# EAGLE schematic AMS Segment rev16 (EAGLE 9.6.2)
ENGINEER: Arvind Srinivasan

## Sheet 1 of 2: Schematic
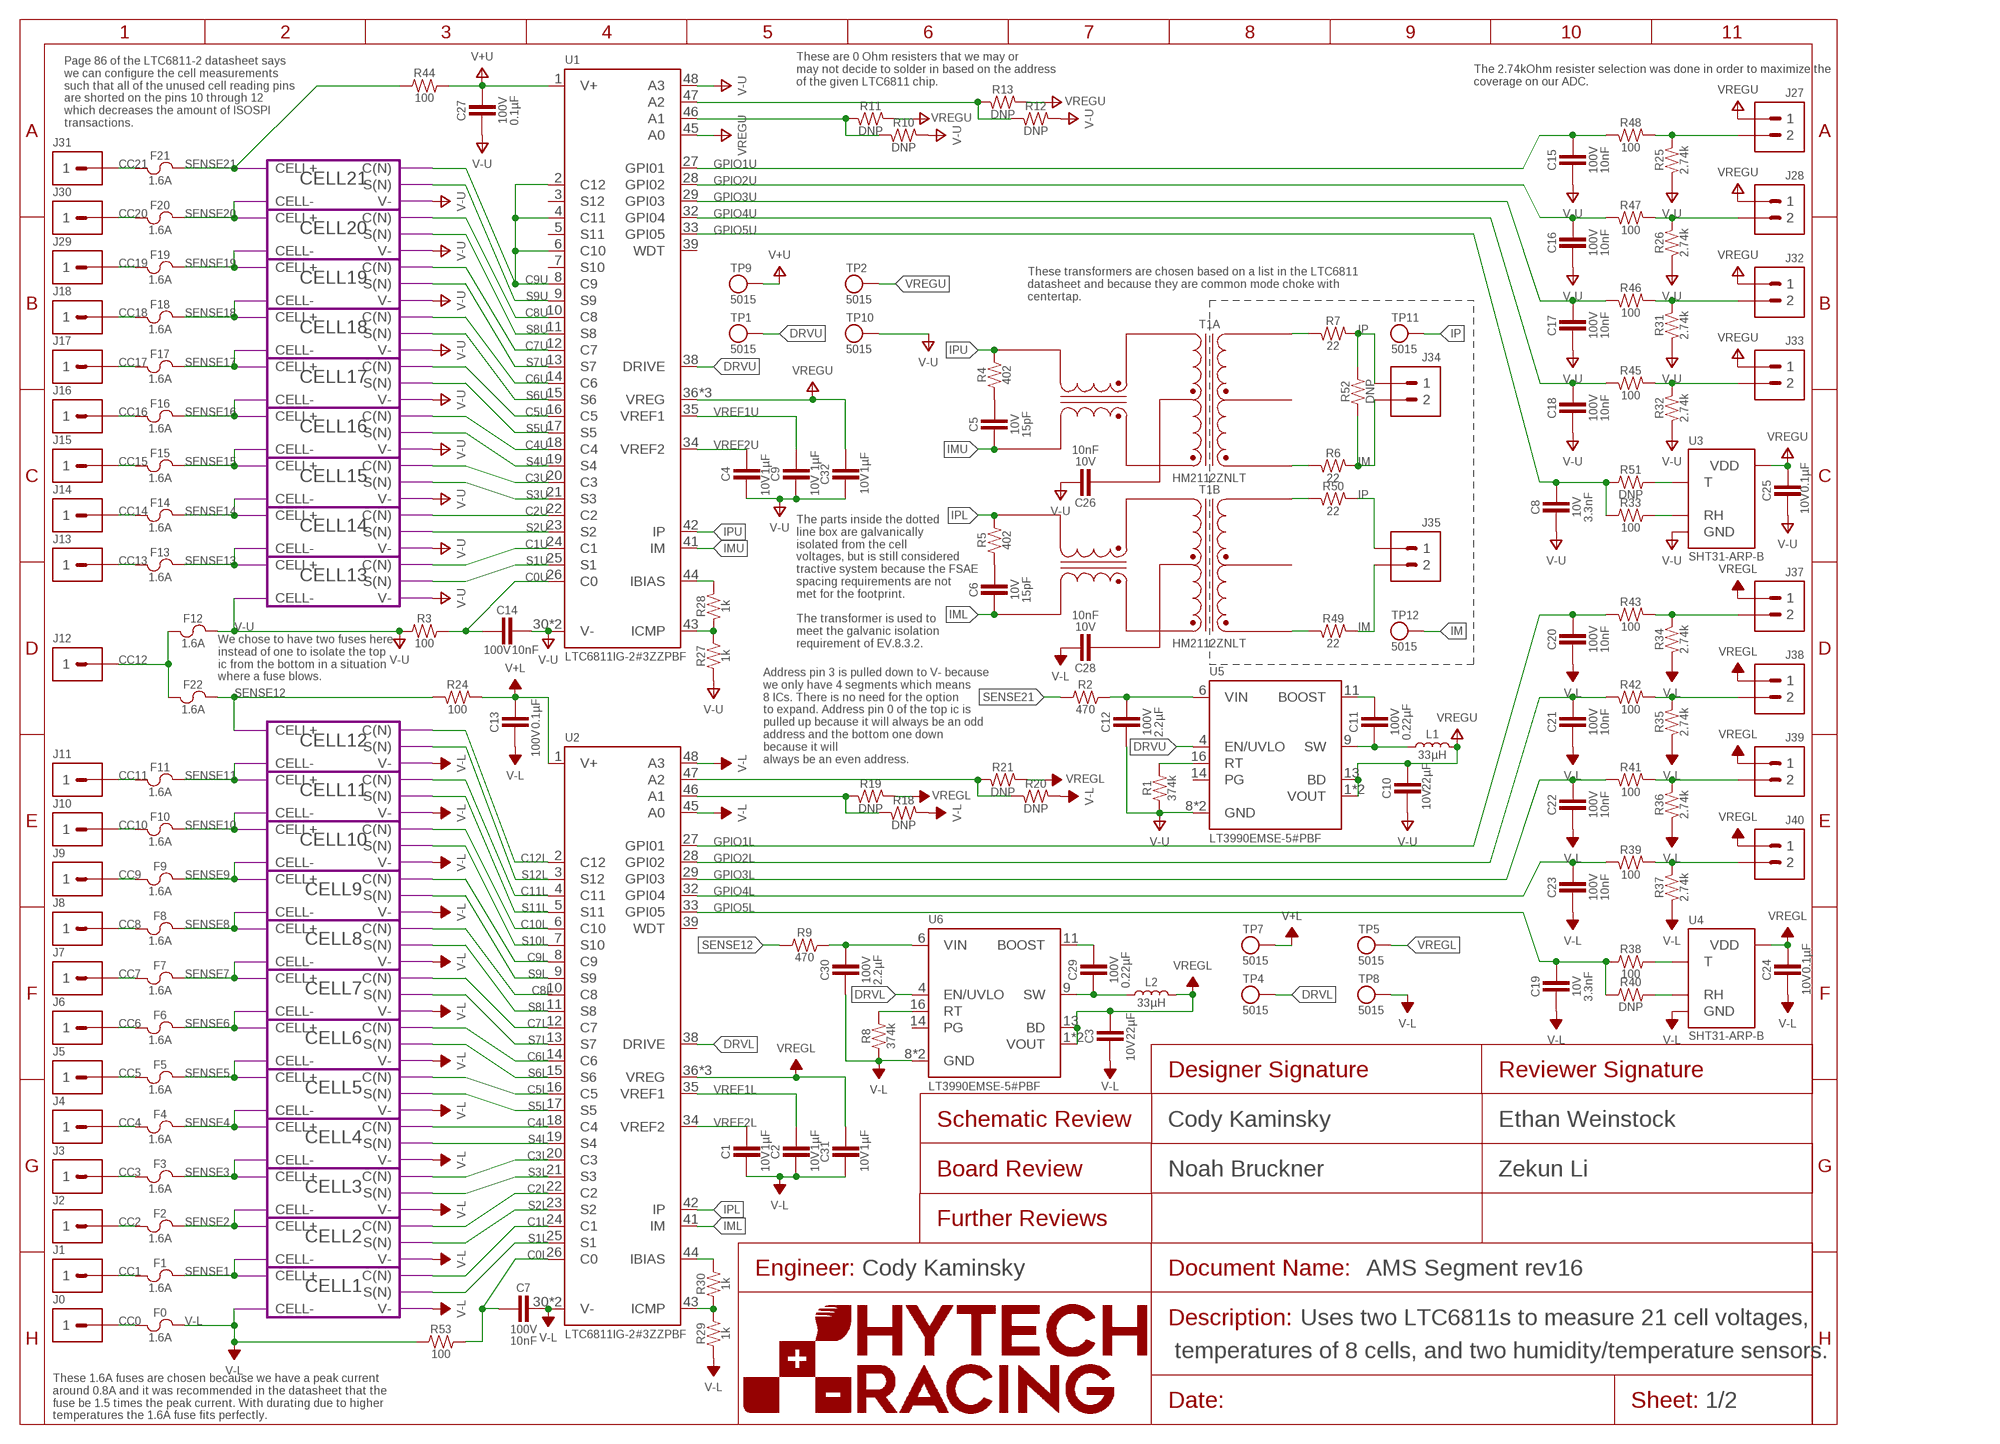
[diagram p0: schematic, sheet 1]
FRAME1 (FRAME): DESCRIPTION_1: Uses two LTC6811s to measure 21 cell voltages,; DESCRIPTION_2: temperatures of 8 cells, and two humidity/temperature sensors.; DESIGNER_BOARD: Noah Bruckner; DESIGNER_SCHEMATIC: Cody Kaminsky; ENGINEER: Cody Kaminsky; REVIEWER_BOARD: Zekun Li; REVIEWER_SCHEMATIC: Ethan Weinstock

### Parts
C1  CAPACITOR_0603_10V_1UF  [0603-CAP]
C2  CAPACITOR_0603_10V_1UF  [0603-CAP]
C3  CAPACITOR_0603_10V_22UF  [0603-CAP]
C4  CAPACITOR_0603_10V_1UF  [0603-CAP]
C5  CAPACITOR_0603_10V_15PF  [0603-CAP]
C6  CAPACITOR_0603_10V_15PF  [0603-CAP]
C7  CAPACITOR_0603_100V_10NF  [0603-CAP]
C8  CAPACITOR_0603_10V_3.3NF  [0603-CAP]
C9  CAPACITOR_0603_10V_1UF  [0603-CAP]
C10  CAPACITOR_0603_10V_22UF  [0603-CAP]
C11  CAPACITOR_0805_100V_0.22UF  [0805-CAP]
C12  CAPACITOR_1206_100V_2.2UF  [1206-CAP]
C13  CAPACITOR_0603_100V_0.1UF  [0603-CAP]
C14  CAPACITOR_0603_100V_10NF  [0603-CAP]
C15  CAPACITOR_0603_100V_10NF  [0603-CAP]
C16  CAPACITOR_0603_100V_10NF  [0603-CAP]
C17  CAPACITOR_0603_100V_10NF  [0603-CAP]
C18  CAPACITOR_0603_100V_10NF  [0603-CAP]
C19  CAPACITOR_0603_10V_3.3NF  [0603-CAP]
C20  CAPACITOR_0603_100V_10NF  [0603-CAP]
C21  CAPACITOR_0603_100V_10NF  [0603-CAP]
C22  CAPACITOR_0603_100V_10NF  [0603-CAP]
C23  CAPACITOR_0603_100V_10NF  [0603-CAP]
C24  CAPACITOR_0603_10V_0.1UF  [0603-CAP]
C25  CAPACITOR_0603_10V_0.1UF  [0603-CAP]
C26  CAPACITOR_0603_10V_10NF  [0603-CAP]
C27  CAPACITOR_0603_100V_0.1UF  [0603-CAP]
C28  CAPACITOR_0603_10V_10NF  [0603-CAP]
C29  CAPACITOR_0805_100V_0.22UF  [0805-CAP]
C30  CAPACITOR_1206_100V_2.2UF  [1206-CAP]
C31  CAPACITOR_0603_10V_1UF  [0603-CAP]
C32  CAPACITOR_0603_10V_1UF  [0603-CAP]
F0  FUSE_0885_1.6  [0885]
F1  FUSE_0885_1.6  [0885]
F2  FUSE_0885_1.6  [0885]
F3  FUSE_0885_1.6  [0885]
F4  FUSE_0885_1.6  [0885]
F5  FUSE_0885_1.6  [0885]
F6  FUSE_0885_1.6  [0885]
F7  FUSE_0885_1.6  [0885]
F8  FUSE_0885_1.6  [0885]
F9  FUSE_0885_1.6  [0885]
F10  FUSE_0885_1.6  [0885]
F11  FUSE_0885_1.6  [0885]
F12  FUSE_0885_1.6  [0885]
F13  FUSE_0885_1.6  [0885]
F14  FUSE_0885_1.6  [0885]
F15  FUSE_0885_1.6  [0885]
F16  FUSE_0885_1.6  [0885]
F17  FUSE_0885_1.6  [0885]
F18  FUSE_0885_1.6  [0885]
F19  FUSE_0885_1.6  [0885]
F20  FUSE_0885_1.6  [0885]
F21  FUSE_0885_1.6  [0885]
F22  FUSE_0885_1.6  [0885]
J0  CONNECTOR-1_5222_  [5222]
J1  CONNECTOR-1_5222_  [5222]
J2  CONNECTOR-1_5222_  [5222]
J3  CONNECTOR-1_5222_  [5222]
J4  CONNECTOR-1_5222_  [5222]
J5  CONNECTOR-1_5222_  [5222]
J6  CONNECTOR-1_5222_  [5222]
J7  CONNECTOR-1_5222_  [5222]
J8  CONNECTOR-1_5222_  [5222]
J9  CONNECTOR-1_5222_  [5222]
J10  CONNECTOR-1_5222_  [5222]
J11  CONNECTOR-1_5222_  [5222]
J12  CONNECTOR-1_5222_  [5222]
J13  CONNECTOR-1_5222_  [5222]
J14  CONNECTOR-1_5222_  [5222]
J15  CONNECTOR-1_5222_  [5222]
J16  CONNECTOR-1_5222_  [5222]
J17  CONNECTOR-1_5222_  [5222]
J18  CONNECTOR-1_5222_  [5222]
J27  CONNECTOR-2_MICROFIT_SMD_RIGHTANGLE_02_SINGLE_BLACK  [MOLEX_MICROFIT_SMD_RIGHTANGLE_02_SINGLE]
J28  CONNECTOR-2_MICROFIT_SMD_RIGHTANGLE_02_SINGLE_BLACK  [MOLEX_MICROFIT_SMD_RIGHTANGLE_02_SINGLE]
J29  CONNECTOR-1_5222_  [5222]
J30  CONNECTOR-1_5222_  [5222]
J31  CONNECTOR-1_5222_  [5222]
J32  CONNECTOR-2_MICROFIT_SMD_RIGHTANGLE_02_SINGLE_BLACK  [MOLEX_MICROFIT_SMD_RIGHTANGLE_02_SINGLE]
J33  CONNECTOR-2_MICROFIT_SMD_RIGHTANGLE_02_SINGLE_BLACK  [MOLEX_MICROFIT_SMD_RIGHTANGLE_02_SINGLE]
J34  CONNECTOR-2_MICROFIT_SMD_RIGHTANGLE_02_SINGLE_BLACK  [MOLEX_MICROFIT_SMD_RIGHTANGLE_02_SINGLE]
J35  CONNECTOR-2_MICROFIT_SMD_RIGHTANGLE_02_SINGLE_BLACK  [MOLEX_MICROFIT_SMD_RIGHTANGLE_02_SINGLE]
J37  CONNECTOR-2_MICROFIT_SMD_RIGHTANGLE_02_SINGLE_BLACK  [MOLEX_MICROFIT_SMD_RIGHTANGLE_02_SINGLE]
J38  CONNECTOR-2_MICROFIT_SMD_RIGHTANGLE_02_SINGLE_BLACK  [MOLEX_MICROFIT_SMD_RIGHTANGLE_02_SINGLE]
J39  CONNECTOR-2_MICROFIT_SMD_RIGHTANGLE_02_SINGLE_BLACK  [MOLEX_MICROFIT_SMD_RIGHTANGLE_02_SINGLE]
J40  CONNECTOR-2_MICROFIT_SMD_RIGHTANGLE_02_SINGLE_BLACK  [MOLEX_MICROFIT_SMD_RIGHTANGLE_02_SINGLE]
L1  INDUCTOR_74451133_33UH  [74451133]
L2  INDUCTOR_74451133_33UH  [74451133]
R1  RESISTOR_0603_374K  [0603-RES]
R2  RESISTOR_0603_470  [0603-RES]
R3  RESISTOR_0603_100  [0603-RES]
R4  RESISTOR_0603_402  [0603-RES]
R5  RESISTOR_0603_402  [0603-RES]
R6  RESISTOR_0603_22  [0603-RES]
R7  RESISTOR_0603_22  [0603-RES]
R8  RESISTOR_0603_374K  [0603-RES]
R9  RESISTOR_0603_470  [0603-RES]
R10  RESISTOR_0603_DNP  [0603-RES]
R11  RESISTOR_0603_DNP  [0603-RES]
R12  RESISTOR_0603_DNP  [0603-RES]
R13  RESISTOR_0603_DNP  [0603-RES]
R18  RESISTOR_0603_DNP  [0603-RES]
R19  RESISTOR_0603_DNP  [0603-RES]
R20  RESISTOR_0603_DNP  [0603-RES]
R21  RESISTOR_0603_DNP  [0603-RES]
R24  RESISTOR_0603_100  [0603-RES]
R25  RESISTOR_0603_2.74K  [0603-RES]
R26  RESISTOR_0603_2.74K  [0603-RES]
R27  RESISTOR_0603_1K  [0603-RES]
R28  RESISTOR_0603_1K  [0603-RES]
R29  RESISTOR_0603_1K  [0603-RES]
R30  RESISTOR_0603_1K  [0603-RES]
R31  RESISTOR_0603_2.74K  [0603-RES]
R32  RESISTOR_0603_2.74K  [0603-RES]
R33  RESISTOR_0603_100  [0603-RES]
R34  RESISTOR_0603_2.74K  [0603-RES]
R35  RESISTOR_0603_2.74K  [0603-RES]
R36  RESISTOR_0603_2.74K  [0603-RES]
R37  RESISTOR_0603_2.74K  [0603-RES]
R38  RESISTOR_0603_100  [0603-RES]
R39  RESISTOR_0603_100  [0603-RES]
R40  RESISTOR_0603_DNP  [0603-RES]
R41  RESISTOR_0603_100  [0603-RES]
R42  RESISTOR_0603_100  [0603-RES]
R43  RESISTOR_0603_100  [0603-RES]
R44  RESISTOR_0603_100  [0603-RES]
R45  RESISTOR_0603_100  [0603-RES]
R46  RESISTOR_0603_100  [0603-RES]
R47  RESISTOR_0603_100  [0603-RES]
R48  RESISTOR_0603_100  [0603-RES]
R49  RESISTOR_0603_22  [0603-RES]
R50  RESISTOR_0603_22  [0603-RES]
R51  RESISTOR_0603_DNP  [0603-RES]
R52  RESISTOR_0603_DNP  [0603-RES]
R53  RESISTOR_0603_100  [0603-RES]
T1  TRANSFORMER_HM2112ZNLT  [HM2112ZNLT]
TP1  TEST_POINT  [MICRO_MINIATURE]
TP2  TEST_POINT  [MICRO_MINIATURE]
TP4  TEST_POINT  [MICRO_MINIATURE]
TP5  TEST_POINT  [MICRO_MINIATURE]
TP7  TEST_POINT  [MICRO_MINIATURE]
TP8  TEST_POINT  [MICRO_MINIATURE]
TP9  TEST_POINT  [MICRO_MINIATURE]
TP10  TEST_POINT  [MICRO_MINIATURE]
TP11  TEST_POINT  [MICRO_MINIATURE]
TP12  TEST_POINT  [MICRO_MINIATURE]
U1  LTC6811-2  [SSOP-48]
U2  LTC6811-2  [SSOP-48]
U3  SHT31-ARP-B  [DFN-8]
U4  SHT31-ARP-B  [DFN-8]
U5  LT3990-5  [MSOP-16(MSE)]
U6  LT3990-5  [MSOP-16(MSE)]

### Module instances
CELL1 = CELL
CELL2 = CELL
CELL3 = CELL
CELL4 = CELL
CELL5 = CELL
CELL6 = CELL
CELL7 = CELL
CELL8 = CELL
CELL9 = CELL
CELL10 = CELL
CELL11 = CELL
CELL12 = CELL
CELL13 = CELL
CELL14 = CELL
CELL15 = CELL
CELL16 = CELL
CELL17 = CELL
CELL18 = CELL
CELL19 = CELL
CELL20 = CELL
CELL21 = CELL

### Nets
C0L [Lower Power]: C7.1 R53.2 U2.26(C0)
C0U [Upper Power]: C14.1 R3.2 U1.26(C0)
C1L [Lower Power]: U2.24(C1) ; port CELL1.C(N)
C1U [Upper Power]: U1.24(C1) ; port CELL13.C(N)
C2L [Lower Power]: U2.22(C2) ; port CELL2.C(N)
C2U [Upper Power]: U1.22(C2) ; port CELL14.C(N)
C3L [Lower Power]: U2.20(C3) ; port CELL3.C(N)
C3U [Upper Power]: U1.20(C3) ; port CELL15.C(N)
C4L [Lower Power]: U2.18(C4) ; port CELL4.C(N)
C4U [Upper Power]: U1.18(C4) ; port CELL16.C(N)
C5L [Lower Power]: U2.16(C5) ; port CELL5.C(N)
C5U [Upper Power]: U1.16(C5) ; port CELL17.C(N)
C6L [Lower Power]: U2.14(C6) ; port CELL6.C(N)
C6U [Upper Power]: U1.14(C6) ; port CELL18.C(N)
C7L [Lower Power]: U2.12(C7) ; port CELL7.C(N)
C7U [Upper Power]: U1.12(C7) ; port CELL19.C(N)
C8L [Lower Power]: U2.10(C8) ; port CELL8.C(N)
C8U [Upper Power]: U1.10(C8) ; port CELL20.C(N)
C9L [Lower Power]: U2.8(C9) ; port CELL9.C(N)
C9U [Upper Power]: U1.2(C12) U1.4(C11) U1.6(C10) U1.8(C9) ; port CELL21.C(N)
C10L [Lower Power]: U2.6(C10) ; port CELL10.C(N)
C11L [Lower Power]: U2.4(C11) ; port CELL11.C(N)
C12L [Lower Power]: U2.2(C12) ; port CELL12.C(N)
CC0 [Lower_Unfused]: F0.1 J0.1
CC1 [Lower_Unfused]: F1.1 J1.1
CC2 [Lower_Unfused]: F2.1 J2.1
CC3 [Lower_Unfused]: F3.1 J3.1
CC4 [Lower_Unfused]: F4.1 J4.1
CC5 [Lower_Unfused]: F5.1 J5.1
CC6 [Lower_Unfused]: F6.1 J6.1
CC7 [Lower_Unfused]: F7.1 J7.1
CC8 [Lower_Unfused]: F8.1 J8.1
CC9 [Lower_Unfused]: F9.1 J9.1
CC10 [Lower_Unfused]: F10.1 J10.1
CC11 [Lower_Unfused]: F11.1 J11.1
CC12 [Upper_Unfused]: F12.1 F22.1 J12.1
CC13 [Upper_Unfused]: F13.1 J13.1
CC14 [Upper_Unfused]: F14.1 J14.1
CC15 [Upper_Unfused]: F15.1 J15.1
CC16 [Upper_Unfused]: F16.1 J16.1
CC17 [Upper_Unfused]: F17.1 J17.1
CC18 [Upper_Unfused]: F18.1 J18.1
CC19 [Upper_Unfused]: F19.1 J29.1
CC20 [Upper_Unfused]: F20.1 J30.1
CC21 [Upper_Unfused]: F21.1 J31.1
DRVL [Lower Power]: TP4.1 U2.38(DRIVE) U6.4(EN/UVLO)
DRVU [Upper Power]: TP1.1 U1.38(DRIVE) U5.4(EN/UVLO)
GPIO1L: C20.1 R43.2 U2.27(GPI01)
GPIO1U: C15.1 R48.2 U1.27(GPI01)
GPIO2L: C21.1 R42.2 U2.28(GPI02)
GPIO2U: C16.1 R47.2 U1.28(GPI02)
GPIO3L: C22.1 R41.2 U2.29(GPI03)
GPIO3U: C17.1 R46.2 U1.29(GPI03)
GPIO4L: C23.1 R39.2 U2.32(GPI04)
GPIO4U: C18.1 R45.2 U1.32(GPI04)
GPIO5L: C19.1 R38.1 R40.1 U2.33(GPI05)
GPIO5U: C8.1 R33.1 R51.1 U1.33(GPI05)
IM [IsoSPI]: J34.2 J35.2 R6.1 R49.1 R52.1 TP12.1
IML: C6.2 T1.9(B:TD+) U2.41(IM)
IMU: C5.2 T1.12(A:TD+) U1.41(IM)
IP [IsoSPI]: J34.1 J35.1 R7.1 R50.1 R52.2 TP11.1
IPL: R5.2 T1.7(B:TD-) U2.42(IP)
IPU: R4.2 T1.10(A:TD-) U1.42(IP)
N$1: R1.2 U5.16(RT)
N$3: C11.2 L1.1 U5.9(SW)
N$4: C11.1 U5.11(BOOST)
N$7: R8.2 U6.16(RT)
N$10: C29.2 L2.1 U6.9(SW)
N$11: C29.1 U6.11(BOOST)
N$12: R33.2 U3.1(RH)
N$18: C26.2 T1.11(A:TCT)
N$22 [IsoSPI]: R6.2 T1.1(A:MX+)
N$25: R10.2 R11.2 U1.46(A1)
N$27 [IsoSPI]: R7.2 T1.3(A:MX-)
N$29: C28.2 T1.8(B:TCT)
N$30: R51.2 U3.4(T)
N$32 [IsoSPI]: R49.2 T1.4(B:MX+)
N$33 [IsoSPI]: R50.2 T1.6(B:MX-)
N$54: R12.2 R13.2 U1.47(A2)
N$61: R27.2 R28.2 U1.43(ICMP)
N$67: R18.2 R19.2 U2.46(A1)
N$68: R20.2 R21.2 U2.47(A2)
N$70: R28.1 U1.44(IBIAS)
N$71: J27.2 R25.1 R48.1
N$72: R29.2 R30.1 U2.43(ICMP)
N$73: R30.2 U2.44(IBIAS)
N$76: J28.2 R26.1 R47.1
N$78: J32.2 R31.1 R46.1
N$80: J33.2 R32.1 R45.1
N$81: R40.2 U4.1(RH)
N$83: R38.2 U4.4(T)
N$84: J37.2 R34.1 R43.1
N$86: J38.2 R35.1 R42.1
N$88: J39.2 R36.1 R41.1
N$90: J40.2 R37.1 R39.1
N$97: C5.1 R4.1
N$99: C6.1 R5.1
S1L [Lower Power]: U2.25(S1) ; port CELL1.S(N)
S1U [Upper Power]: U1.25(S1) ; port CELL13.S(N)
S2L [Lower Power]: U2.23(S2) ; port CELL2.S(N)
S2U [Upper Power]: U1.23(S2) ; port CELL14.S(N)
S3L [Lower Power]: U2.21(S3) ; port CELL3.S(N)
S3U [Upper Power]: U1.21(S3) ; port CELL15.S(N)
S4L [Lower Power]: U2.19(S4) ; port CELL4.S(N)
S4U [Upper Power]: U1.19(S4) ; port CELL16.S(N)
S5L [Lower Power]: U2.17(S5) ; port CELL5.S(N)
S5U [Upper Power]: U1.17(S5) ; port CELL17.S(N)
S6L [Lower Power]: U2.15(S6) ; port CELL6.S(N)
S6U [Upper Power]: U1.15(S6) ; port CELL18.S(N)
S7L [Lower Power]: U2.13(S7) ; port CELL7.S(N)
S7U [Upper Power]: U1.13(S7) ; port CELL19.S(N)
S8L [Lower Power]: U2.11(S8) ; port CELL8.S(N)
S8U [Upper Power]: U1.11(S8) ; port CELL20.S(N)
S9L [Lower Power]: U2.9(S9) ; port CELL9.S(N)
S9U [Upper Power]: U1.9(S9) ; port CELL21.S(N)
S10L [Lower Power]: U2.7(S10) ; port CELL10.S(N)
S11L [Lower Power]: U2.5(S11) ; port CELL11.S(N)
S12L [Lower Power]: U2.3(S12) ; port CELL12.S(N)
SENSE1 [Lower Power]: F1.2 ; port CELL1.CELL+ CELL2.CELL-
SENSE2 [Lower Power]: F2.2 ; port CELL2.CELL+ CELL3.CELL-
SENSE3 [Lower Power]: F3.2 ; port CELL3.CELL+ CELL4.CELL-
SENSE4 [Lower Power]: F4.2 ; port CELL4.CELL+ CELL5.CELL-
SENSE5 [Lower Power]: F5.2 ; port CELL5.CELL+ CELL6.CELL-
SENSE6 [Lower Power]: F6.2 ; port CELL6.CELL+ CELL7.CELL-
SENSE7 [Lower Power]: F7.2 ; port CELL7.CELL+ CELL8.CELL-
SENSE8 [Lower Power]: F8.2 ; port CELL8.CELL+ CELL9.CELL-
SENSE9 [Lower Power]: F9.2 ; port CELL9.CELL+ CELL10.CELL-
SENSE10 [Lower Power]: F10.2 ; port CELL10.CELL+ CELL11.CELL-
SENSE11 [Lower Power]: F11.2 ; port CELL11.CELL+ CELL12.CELL-
SENSE12 [Lower Power]: F22.2 R9.1 R24.2 ; port CELL12.CELL+
SENSE13 [Upper Power]: F13.2 ; port CELL13.CELL+ CELL14.CELL-
SENSE14 [Upper Power]: F14.2 ; port CELL14.CELL+ CELL15.CELL-
SENSE15 [Upper Power]: F15.2 ; port CELL15.CELL+ CELL16.CELL-
SENSE16 [Upper Power]: F16.2 ; port CELL16.CELL+ CELL17.CELL-
SENSE17 [Upper Power]: F17.2 ; port CELL17.CELL+ CELL18.CELL-
SENSE18 [Upper Power]: F18.2 ; port CELL18.CELL+ CELL19.CELL-
SENSE19 [Upper Power]: F19.2 ; port CELL19.CELL+ CELL20.CELL-
SENSE20 [Upper Power]: F20.2 ; port CELL20.CELL+ CELL21.CELL-
SENSE21 [Upper Power]: F21.2 R2.1 R44.1 ; port CELL21.CELL+
V+L [Lower Power]: C13.1 R24.1 TP7.1 U2.1(V+)
V+U [Upper Power]: C27.1 R44.2 TP9.1 U1.1(V+)
V-L [Lower Power]: C1.2 C2.2 C3.2 C7.2 C13.2 C19.2 C20.2 C21.2 C22.2 C23.2 C24.2 C28.1 C30.2 C31.2 F0.2 R8.1 R18.1 R20.1 R29.1 R34.2 R35.2 R36.2 R37.2 R53.1 TP8.1 U2.30(V-) U2.31(V-) U2.45(A0) U2.48(A3) U4.2(GND) U4.3(GND) U4.7(GND) U4.8(GND) U4.PAD(GND) U6.8(GND) U6.17(GND) ; port CELL12.V- CELL11.V- CELL10.V- CELL9.V- CELL8.V- CELL7.V- CELL6.V- CELL5.V- CELL4.V- CELL3.V- CELL2.V- CELL1.V- CELL1.CELL-
V-U [Upper Power]: C4.2 C8.2 C9.2 C10.2 C12.2 C14.2 C15.2 C16.2 C17.2 C18.2 C25.2 C26.1 C27.2 C32.2 F12.2 R1.1 R3.1 R10.1 R12.1 R25.2 R26.2 R27.1 R31.2 R32.2 TP10.1 U1.30(V-) U1.31(V-) U1.48(A3) U3.2(GND) U3.3(GND) U3.7(GND) U3.8(GND) U3.PAD(GND) U5.8(GND) U5.17(GND) ; port CELL21.V- CELL20.V- CELL19.V- CELL18.V- CELL17.V- CELL16.V- CELL15.V- CELL14.V- CELL13.V- CELL13.CELL-
VINL: C30.1 R9.2 U6.6(VIN)
VINU: C12.1 R2.2 U5.6(VIN)
VREF1L [Lower Power]: C2.1 U2.35(VREF1)
VREF1U [Upper Power]: C9.1 U1.35(VREF1)
VREF2L [Lower Power]: C1.1 U2.34(VREF2)
VREF2U [Upper Power]: C4.1 U1.34(VREF2)
VREGL [Lower Power]: C3.1 C24.1 C31.1 J37.1 J38.1 J39.1 J40.1 L2.2 R19.1 R21.1 TP5.1 U2.36(VREG) U2.37(VREG) U2.40(VREG) U4.5(VDD) U6.1(VOUT) U6.2(VOUT) U6.13(BD)
VREGU [Upper Power]: C10.1 C25.1 C32.1 J27.1 J28.1 J32.1 J33.1 L1.2 R11.1 R13.1 TP2.1 U1.36(VREG) U1.37(VREG) U1.40(VREG) U1.45(A0) U3.5(VDD) U5.1(VOUT) U5.2(VOUT) U5.13(BD)
Unconnected: T1.2(A:MCT) T1.5(B:MCT) U1.3(S12) U1.5(S11) U1.7(S10) U1.39(WDT) U2.39(WDT) U5.14(PG) U6.14(PG)

### Notes on the sheet
- These are 0 Ohm resisters that we may or 
  may not decide to solder in based on the address
  of the given LTC6811 chip.
- The 2.74kOhm resister selection was done in order to maximize the
  coverage on our ADC.
- Page 86 of the LTC6811-2 datasheet says
  we can configure the cell measurements
  such that all of the unused cell reading pins
  are shorted on the pins 10 through 12
  which decreases the amount of ISOSPI
  transactions.
- These transformers are chosen based on a list in the LTC6811
  datasheet and because they are common mode choke with
  centertap.
- The parts inside the dotted
  line box are galvanically
  isolated from the cell
  voltages, but is still considered
  tractive system because the FSAE
  spacing requirements are not
  met for the footprint.
  
  The transformer is used to
  meet the galvanic isolation
  requirement of EV.8.3.2.
- We chose to have two fuses here 
  instead of one to isolate the top 
  ic from the bottom in a situation 
  where a fuse blows.
- Address pin 3 is pulled down to V- because 
  we only have 4 segments which means
  8 ICs. There is no need for the option
  to expand. Address pin 0 of the top ic is
  pulled up because it will always be an odd
  address and the bottom one down
  because it will 
  always be an even address.
- These 1.6A fuses are chosen because we have a peak current
  around 0.8A and it was recommended in the datasheet that the
  fuse be 1.5 times the peak current. With durating due to higher
  temperatures the 1.6A fuse fits perfectly.

## Sheet 2 of 2
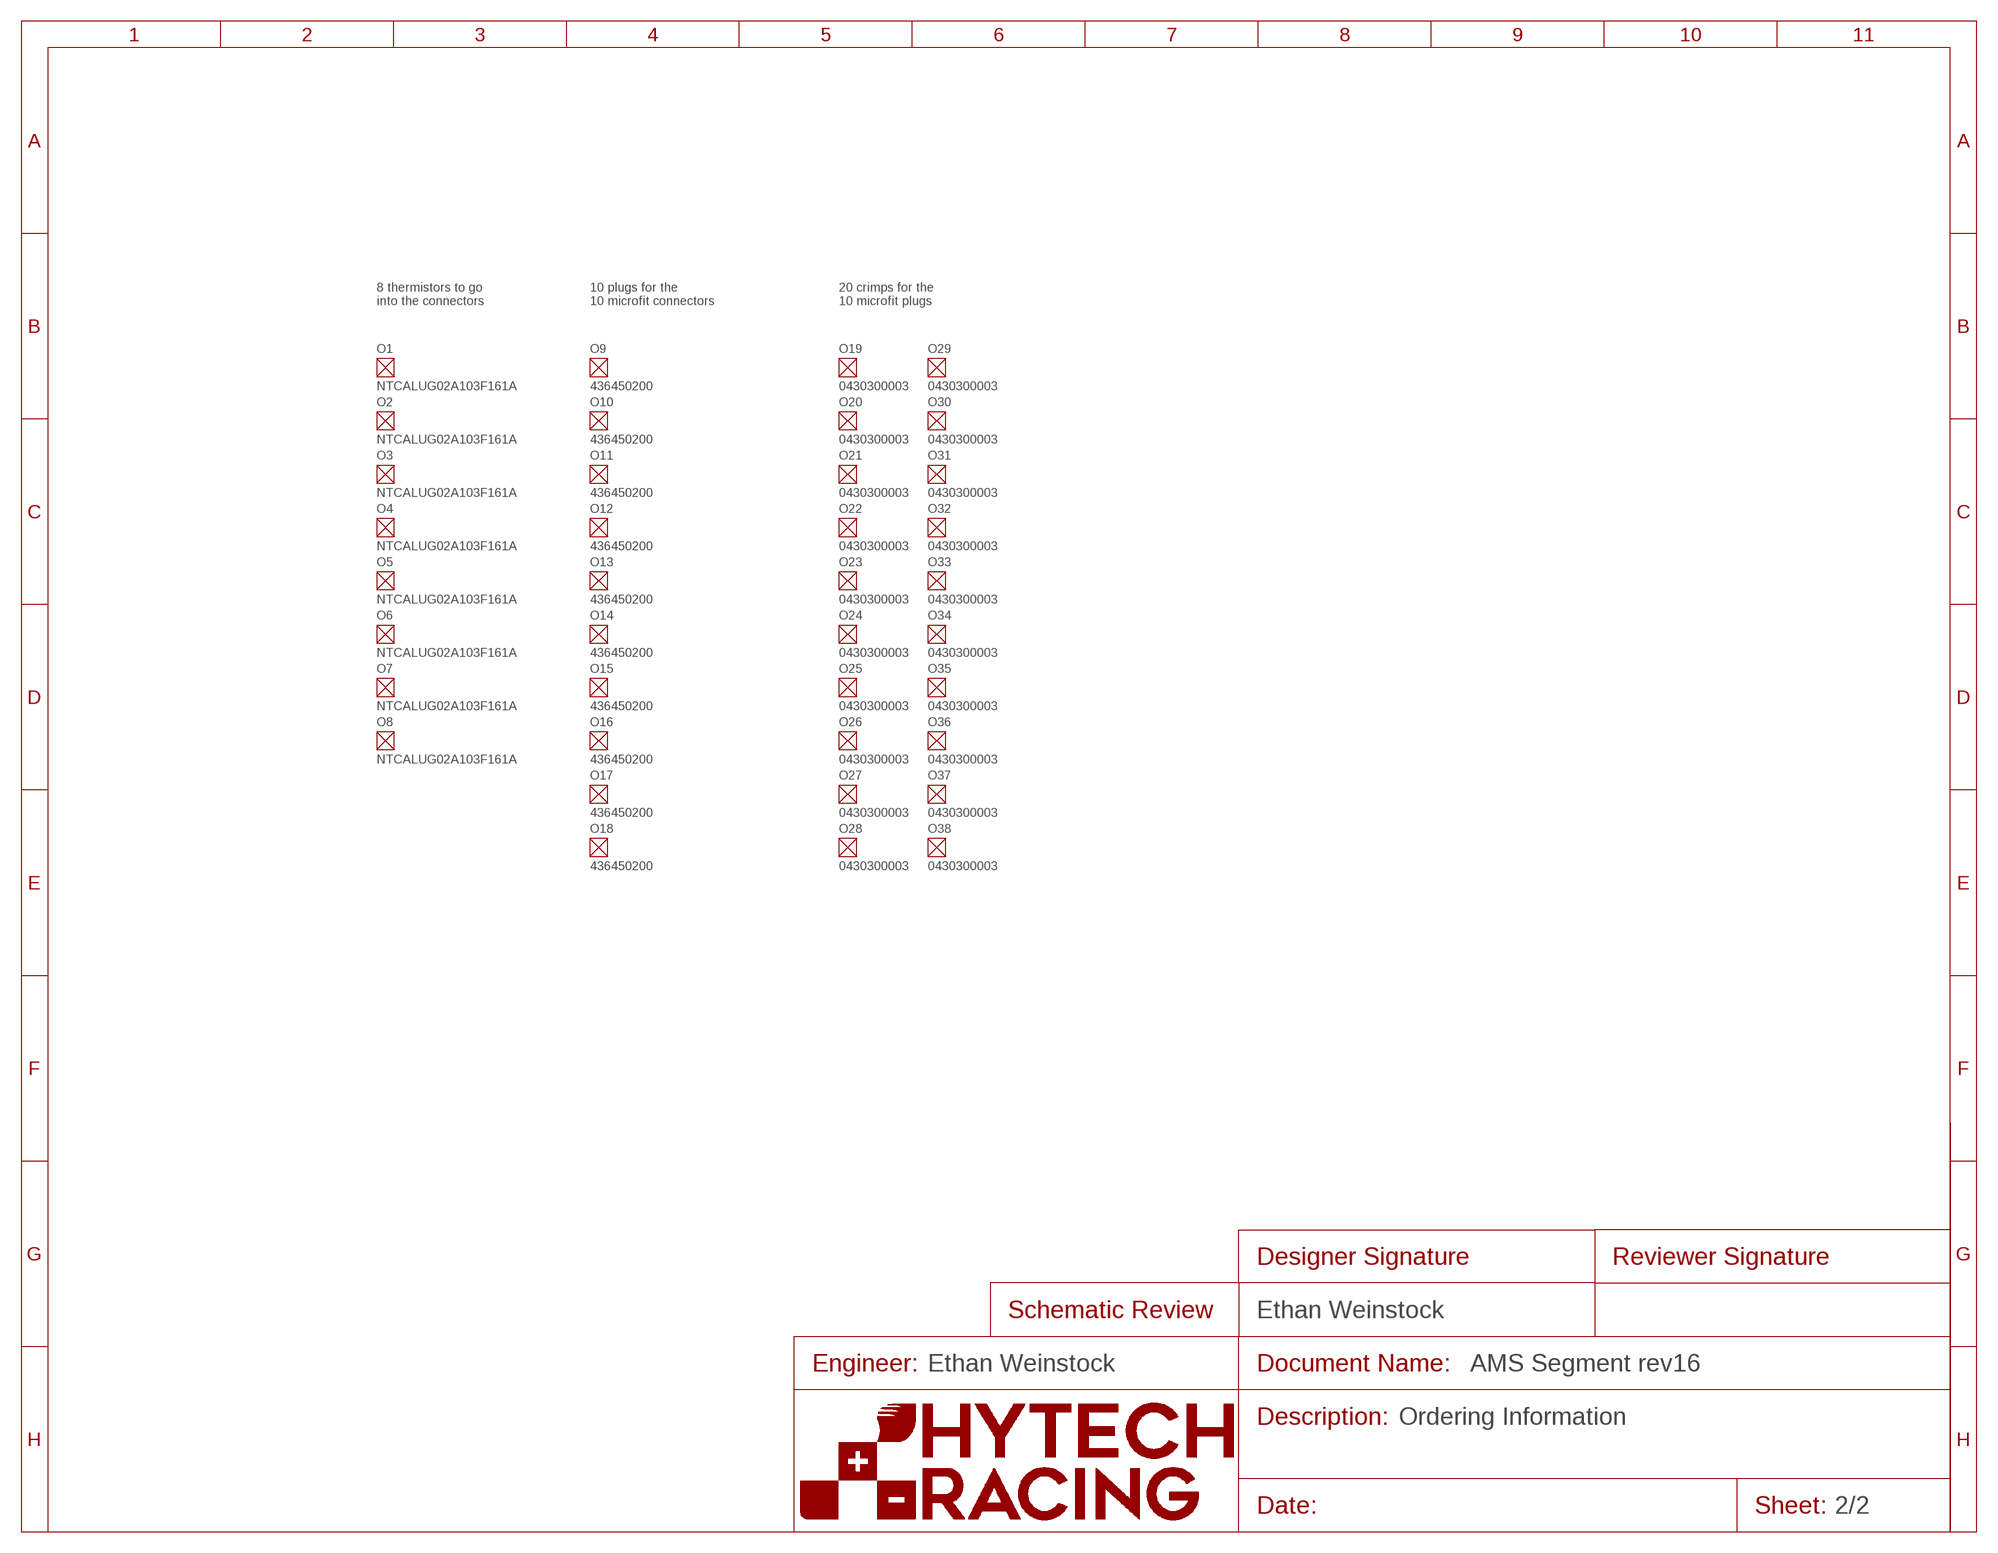
[diagram p1: schematic, sheet 2]
O1 (THERMISTOR): B: 3984K; B_RANGE: 25/85; DKPN: 56-NTCALUG02A103F161A-ND; MANUFACTURER: Vishay Beyschlag/Draloric/BC Components; MOPN: 594-NTLUG02A103F161A; MPN: NTCALUG02A103F161A; TOLERANCE_B: 0.5%; TOLERANCE_RESISTANCE: 1%
O2 (THERMISTOR): B: 3984K; B_RANGE: 25/85; DKPN: 56-NTCALUG02A103F161A-ND; MANUFACTURER: Vishay Beyschlag/Draloric/BC Components; MOPN: 594-NTLUG02A103F161A; MPN: NTCALUG02A103F161A; TOLERANCE_B: 0.5%; TOLERANCE_RESISTANCE: 1%
O3 (THERMISTOR): B: 3984K; B_RANGE: 25/85; DKPN: 56-NTCALUG02A103F161A-ND; MANUFACTURER: Vishay Beyschlag/Draloric/BC Components; MOPN: 594-NTLUG02A103F161A; MPN: NTCALUG02A103F161A; TOLERANCE_B: 0.5%; TOLERANCE_RESISTANCE: 1%
O4 (THERMISTOR): B: 3984K; B_RANGE: 25/85; DKPN: 56-NTCALUG02A103F161A-ND; MANUFACTURER: Vishay Beyschlag/Draloric/BC Components; MOPN: 594-NTLUG02A103F161A; MPN: NTCALUG02A103F161A; TOLERANCE_B: 0.5%; TOLERANCE_RESISTANCE: 1%
O5 (THERMISTOR): B: 3984K; B_RANGE: 25/85; DKPN: 56-NTCALUG02A103F161A-ND; MANUFACTURER: Vishay Beyschlag/Draloric/BC Components; MOPN: 594-NTLUG02A103F161A; MPN: NTCALUG02A103F161A; TOLERANCE_B: 0.5%; TOLERANCE_RESISTANCE: 1%
O6 (THERMISTOR): B: 3984K; B_RANGE: 25/85; DKPN: 56-NTCALUG02A103F161A-ND; MANUFACTURER: Vishay Beyschlag/Draloric/BC Components; MOPN: 594-NTLUG02A103F161A; MPN: NTCALUG02A103F161A; TOLERANCE_B: 0.5%; TOLERANCE_RESISTANCE: 1%
O7 (THERMISTOR): B: 3984K; B_RANGE: 25/85; DKPN: 56-NTCALUG02A103F161A-ND; MANUFACTURER: Vishay Beyschlag/Draloric/BC Components; MOPN: 594-NTLUG02A103F161A; MPN: NTCALUG02A103F161A; TOLERANCE_B: 0.5%; TOLERANCE_RESISTANCE: 1%
O8 (THERMISTOR): B: 3984K; B_RANGE: 25/85; DKPN: 56-NTCALUG02A103F161A-ND; MANUFACTURER: Vishay Beyschlag/Draloric/BC Components; MOPN: 594-NTLUG02A103F161A; MPN: NTCALUG02A103F161A; TOLERANCE_B: 0.5%; TOLERANCE_RESISTANCE: 1%
O9 (PLUG-2_MICROFIT_HORIZONTAL): DKPN: WM1845-ND; MANUFACTURER: Molex; MOPN: Molex; MPN: 436450200
O10 (PLUG-2_MICROFIT_HORIZONTAL): DKPN: WM1845-ND; MANUFACTURER: Molex; MOPN: Molex; MPN: 436450200
O11 (PLUG-2_MICROFIT_HORIZONTAL): DKPN: WM1845-ND; MANUFACTURER: Molex; MOPN: Molex; MPN: 436450200
O12 (PLUG-2_MICROFIT_HORIZONTAL): DKPN: WM1845-ND; MANUFACTURER: Molex; MOPN: Molex; MPN: 436450200
O13 (PLUG-2_MICROFIT_HORIZONTAL): DKPN: WM1845-ND; MANUFACTURER: Molex; MOPN: Molex; MPN: 436450200
O14 (PLUG-2_MICROFIT_HORIZONTAL): DKPN: WM1845-ND; MANUFACTURER: Molex; MOPN: Molex; MPN: 436450200
O15 (PLUG-2_MICROFIT_HORIZONTAL): DKPN: WM1845-ND; MANUFACTURER: Molex; MOPN: Molex; MPN: 436450200
O16 (PLUG-2_MICROFIT_HORIZONTAL): DKPN: WM1845-ND; MANUFACTURER: Molex; MOPN: Molex; MPN: 436450200
O17 (PLUG-2_MICROFIT_HORIZONTAL): DKPN: WM1845-ND; MANUFACTURER: Molex; MOPN: Molex; MPN: 436450200
O18 (PLUG-2_MICROFIT_HORIZONTAL): DKPN: WM1845-ND; MANUFACTURER: Molex; MOPN: Molex; MPN: 436450200
O19 (CRIMP_MICROFIT_20-24): DKPN: WM2776CT-ND; GAUGE: 20-24; MANUFACTURER: Molex; MOPN: 538-43030-0003; MPN: 0430300003
O20 (CRIMP_MICROFIT_20-24): DKPN: WM2776CT-ND; GAUGE: 20-24; MANUFACTURER: Molex; MOPN: 538-43030-0003; MPN: 0430300003
O21 (CRIMP_MICROFIT_20-24): DKPN: WM2776CT-ND; GAUGE: 20-24; MANUFACTURER: Molex; MOPN: 538-43030-0003; MPN: 0430300003
O22 (CRIMP_MICROFIT_20-24): DKPN: WM2776CT-ND; GAUGE: 20-24; MANUFACTURER: Molex; MOPN: 538-43030-0003; MPN: 0430300003
O23 (CRIMP_MICROFIT_20-24): DKPN: WM2776CT-ND; GAUGE: 20-24; MANUFACTURER: Molex; MOPN: 538-43030-0003; MPN: 0430300003
O24 (CRIMP_MICROFIT_20-24): DKPN: WM2776CT-ND; GAUGE: 20-24; MANUFACTURER: Molex; MOPN: 538-43030-0003; MPN: 0430300003
O25 (CRIMP_MICROFIT_20-24): DKPN: WM2776CT-ND; GAUGE: 20-24; MANUFACTURER: Molex; MOPN: 538-43030-0003; MPN: 0430300003
O26 (CRIMP_MICROFIT_20-24): DKPN: WM2776CT-ND; GAUGE: 20-24; MANUFACTURER: Molex; MOPN: 538-43030-0003; MPN: 0430300003
O27 (CRIMP_MICROFIT_20-24): DKPN: WM2776CT-ND; GAUGE: 20-24; MANUFACTURER: Molex; MOPN: 538-43030-0003; MPN: 0430300003
O28 (CRIMP_MICROFIT_20-24): DKPN: WM2776CT-ND; GAUGE: 20-24; MANUFACTURER: Molex; MOPN: 538-43030-0003; MPN: 0430300003
O29 (CRIMP_MICROFIT_20-24): DKPN: WM2776CT-ND; GAUGE: 20-24; MANUFACTURER: Molex; MOPN: 538-43030-0003; MPN: 0430300003
O30 (CRIMP_MICROFIT_20-24): DKPN: WM2776CT-ND; GAUGE: 20-24; MANUFACTURER: Molex; MOPN: 538-43030-0003; MPN: 0430300003
O31 (CRIMP_MICROFIT_20-24): DKPN: WM2776CT-ND; GAUGE: 20-24; MANUFACTURER: Molex; MOPN: 538-43030-0003; MPN: 0430300003
O32 (CRIMP_MICROFIT_20-24): DKPN: WM2776CT-ND; GAUGE: 20-24; MANUFACTURER: Molex; MOPN: 538-43030-0003; MPN: 0430300003
O33 (CRIMP_MICROFIT_20-24): DKPN: WM2776CT-ND; GAUGE: 20-24; MANUFACTURER: Molex; MOPN: 538-43030-0003; MPN: 0430300003
O34 (CRIMP_MICROFIT_20-24): DKPN: WM2776CT-ND; GAUGE: 20-24; MANUFACTURER: Molex; MOPN: 538-43030-0003; MPN: 0430300003
O35 (CRIMP_MICROFIT_20-24): DKPN: WM2776CT-ND; GAUGE: 20-24; MANUFACTURER: Molex; MOPN: 538-43030-0003; MPN: 0430300003
O36 (CRIMP_MICROFIT_20-24): DKPN: WM2776CT-ND; GAUGE: 20-24; MANUFACTURER: Molex; MOPN: 538-43030-0003; MPN: 0430300003
O37 (CRIMP_MICROFIT_20-24): DKPN: WM2776CT-ND; GAUGE: 20-24; MANUFACTURER: Molex; MOPN: 538-43030-0003; MPN: 0430300003
O38 (CRIMP_MICROFIT_20-24): DKPN: WM2776CT-ND; GAUGE: 20-24; MANUFACTURER: Molex; MOPN: 538-43030-0003; MPN: 0430300003
U$30 (FRAME_SCHEMATIC_ONLY): DESCRIPTION_1: Ordering Information; DESIGNER_SCHEMATIC: Ethan Weinstock; ENGINEER: Ethan Weinstock

### Notes on the sheet
- 8 thermistors to go
  into the connectors
- 10 plugs for the 
  10 microfit connectors
- 20 crimps for the 
  10 microfit plugs

## Library data of the parts
C1 C2 C4 C9 C31 C32 = HyTechDevices:CAPACITOR_?_*: Capacitor, Non-Polarized VJ...1BC Series Datasheet <https://www.mouser.com/datasheet/2/427/vjw1bcbascomseries-1762447.pdf> Samsung Datasheet <https://www.mouser.com/datasheet/2/585/MLCC-1837944.pdf> Walsin Datasheet <https://www.mouser.com/datasheet/2/210/WTC_MLCC_General_Purpose-1534899.pdf> GRM188R61A226ME15D <https://www.mouser.com/datasheet/2/281/1/GRM188R61A226ME15_02A-1985787.pdf> GRM188R61E106MA73D <https://www.mouser.com/datasheet/2/281/1/GRM188R61E106MA73_01A-1985806.pdf> 885012006013 <https://www.mouser.com/datasheet/2/445/885012006013-1726946.pdf> 2220Y6300105KXTWS2 <https://www.mouser.com/datasheet/2/218/SMD_High_and_Std_StackiCap_P62-1825512.pdf> Yageo Class 2, X5R <https://www.mouser.com/datasheet/2/447/UPY_GPHC_X5R_4V_to_50V_26-1827097.pdf> TDK C Series <https://www.mouser.com/ProductDetail/TDK/C3216X5R1V226M160AC?qs=%2Fha2pyFadujbcx9jh7lYl%2F4NeMoXFhdc8AqVWNq4wW6M2y7zl6GzBuhgtI0ngznN> AVX Automotive MLCC <https://www.mouser.com/datasheet/2/40/AutoMLCC-777028.pdf> KEMET X7R Series <https://www.mouser.com/datasheet/2/212/KEM_C1002_X7R_SMD-1102033.pdf>; CAPACITANCE: 1µF; DKPN: 311-1796-1-ND; MANUFACTURER: Yageo; MOPN: 603-CC603KRX7R6BB105; MPN: CC0603KRX7R6BB105; TOLERANCE: 10%; VOLTAGE: 10V
C3 C10 = HyTechDevices:CAPACITOR_?_*: Capacitor, Non-Polarized VJ...1BC Series Datasheet <https://www.mouser.com/datasheet/2/427/vjw1bcbascomseries-1762447.pdf> Samsung Datasheet <https://www.mouser.com/datasheet/2/585/MLCC-1837944.pdf> Walsin Datasheet <https://www.mouser.com/datasheet/2/210/WTC_MLCC_General_Purpose-1534899.pdf> GRM188R61A226ME15D <https://www.mouser.com/datasheet/2/281/1/GRM188R61A226ME15_02A-1985787.pdf> GRM188R61E106MA73D <https://www.mouser.com/datasheet/2/281/1/GRM188R61E106MA73_01A-1985806.pdf> 885012006013 <https://www.mouser.com/datasheet/2/445/885012006013-1726946.pdf> 2220Y6300105KXTWS2 <https://www.mouser.com/datasheet/2/218/SMD_High_and_Std_StackiCap_P62-1825512.pdf> Yageo Class 2, X5R <https://www.mouser.com/datasheet/2/447/UPY_GPHC_X5R_4V_to_50V_26-1827097.pdf> TDK C Series <https://www.mouser.com/ProductDetail/TDK/C3216X5R1V226M160AC?qs=%2Fha2pyFadujbcx9jh7lYl%2F4NeMoXFhdc8AqVWNq4wW6M2y7zl6GzBuhgtI0ngznN> AVX Automotive MLCC <https://www.mouser.com/datasheet/2/40/AutoMLCC-777028.pdf> KEMET X7R Series <https://www.mouser.com/datasheet/2/212/KEM_C1002_X7R_SMD-1102033.pdf>; CAPACITANCE: 22µF; DKPN: 490-10476-1-ND; MANUFACTURER: Murata Electronics; MOPN: 81-GRM188R61A226ME5D; MPN: GRM188R61A226ME15D; TOLERANCE: 20%; VOLTAGE: 10V
C5 C6 = HyTechDevices:CAPACITOR_?_*: Capacitor, Non-Polarized VJ...1BC Series Datasheet <https://www.mouser.com/datasheet/2/427/vjw1bcbascomseries-1762447.pdf> Samsung Datasheet <https://www.mouser.com/datasheet/2/585/MLCC-1837944.pdf> Walsin Datasheet <https://www.mouser.com/datasheet/2/210/WTC_MLCC_General_Purpose-1534899.pdf> GRM188R61A226ME15D <https://www.mouser.com/datasheet/2/281/1/GRM188R61A226ME15_02A-1985787.pdf> GRM188R61E106MA73D <https://www.mouser.com/datasheet/2/281/1/GRM188R61E106MA73_01A-1985806.pdf> 885012006013 <https://www.mouser.com/datasheet/2/445/885012006013-1726946.pdf> 2220Y6300105KXTWS2 <https://www.mouser.com/datasheet/2/218/SMD_High_and_Std_StackiCap_P62-1825512.pdf> Yageo Class 2, X5R <https://www.mouser.com/datasheet/2/447/UPY_GPHC_X5R_4V_to_50V_26-1827097.pdf> TDK C Series <https://www.mouser.com/ProductDetail/TDK/C3216X5R1V226M160AC?qs=%2Fha2pyFadujbcx9jh7lYl%2F4NeMoXFhdc8AqVWNq4wW6M2y7zl6GzBuhgtI0ngznN> AVX Automotive MLCC <https://www.mouser.com/datasheet/2/40/AutoMLCC-777028.pdf> KEMET X7R Series <https://www.mouser.com/datasheet/2/212/KEM_C1002_X7R_SMD-1102033.pdf>; CAPACITANCE: 15pF; DKPN: 720-VJ0603A150FXQPW1BCCT-ND; MANUFACTURER: Vishay Vitramon; MOPN: 77-VJ0603A150FXQPBC; MPN: VJ0603A150FXQPW1BC; TOLERANCE: 1%; VOLTAGE: 10V
C7 C14-C18 C20-C23 = HyTechDevices:CAPACITOR_?_*: Capacitor, Non-Polarized VJ...1BC Series Datasheet <https://www.mouser.com/datasheet/2/427/vjw1bcbascomseries-1762447.pdf> Samsung Datasheet <https://www.mouser.com/datasheet/2/585/MLCC-1837944.pdf> Walsin Datasheet <https://www.mouser.com/datasheet/2/210/WTC_MLCC_General_Purpose-1534899.pdf> GRM188R61A226ME15D <https://www.mouser.com/datasheet/2/281/1/GRM188R61A226ME15_02A-1985787.pdf> GRM188R61E106MA73D <https://www.mouser.com/datasheet/2/281/1/GRM188R61E106MA73_01A-1985806.pdf> 885012006013 <https://www.mouser.com/datasheet/2/445/885012006013-1726946.pdf> 2220Y6300105KXTWS2 <https://www.mouser.com/datasheet/2/218/SMD_High_and_Std_StackiCap_P62-1825512.pdf> Yageo Class 2, X5R <https://www.mouser.com/datasheet/2/447/UPY_GPHC_X5R_4V_to_50V_26-1827097.pdf> TDK C Series <https://www.mouser.com/ProductDetail/TDK/C3216X5R1V226M160AC?qs=%2Fha2pyFadujbcx9jh7lYl%2F4NeMoXFhdc8AqVWNq4wW6M2y7zl6GzBuhgtI0ngznN> AVX Automotive MLCC <https://www.mouser.com/datasheet/2/40/AutoMLCC-777028.pdf> KEMET X7R Series <https://www.mouser.com/datasheet/2/212/KEM_C1002_X7R_SMD-1102033.pdf>; CAPACITANCE: 10nF; DKPN: 311-1788-1-ND; MANUFACTURER: Yageo; MOPN: 603-CC603KRX7R0BB103; MPN: CC0603KRX7R0BB103; TOLERANCE: 10%; VOLTAGE: 100V
C8 C19 = HyTechDevices:CAPACITOR_?_*: Capacitor, Non-Polarized VJ...1BC Series Datasheet <https://www.mouser.com/datasheet/2/427/vjw1bcbascomseries-1762447.pdf> Samsung Datasheet <https://www.mouser.com/datasheet/2/585/MLCC-1837944.pdf> Walsin Datasheet <https://www.mouser.com/datasheet/2/210/WTC_MLCC_General_Purpose-1534899.pdf> GRM188R61A226ME15D <https://www.mouser.com/datasheet/2/281/1/GRM188R61A226ME15_02A-1985787.pdf> GRM188R61E106MA73D <https://www.mouser.com/datasheet/2/281/1/GRM188R61E106MA73_01A-1985806.pdf> 885012006013 <https://www.mouser.com/datasheet/2/445/885012006013-1726946.pdf> 2220Y6300105KXTWS2 <https://www.mouser.com/datasheet/2/218/SMD_High_and_Std_StackiCap_P62-1825512.pdf> Yageo Class 2, X5R <https://www.mouser.com/datasheet/2/447/UPY_GPHC_X5R_4V_to_50V_26-1827097.pdf> TDK C Series <https://www.mouser.com/ProductDetail/TDK/C3216X5R1V226M160AC?qs=%2Fha2pyFadujbcx9jh7lYl%2F4NeMoXFhdc8AqVWNq4wW6M2y7zl6GzBuhgtI0ngznN> AVX Automotive MLCC <https://www.mouser.com/datasheet/2/40/AutoMLCC-777028.pdf> KEMET X7R Series <https://www.mouser.com/datasheet/2/212/KEM_C1002_X7R_SMD-1102033.pdf>; CAPACITANCE: 3.3nF; DKPN: 732-7759-1-ND; MANUFACTURER: Würth Elektronik; MOPN: 710-885012006016; MPN: 885012006016; TOLERANCE: 5%; VOLTAGE: 10V
C11 C29 = HyTechDevices:CAPACITOR_?_*: Capacitor, Non-Polarized VJ...1BC Series Datasheet <https://www.mouser.com/datasheet/2/427/vjw1bcbascomseries-1762447.pdf> Samsung Datasheet <https://www.mouser.com/datasheet/2/585/MLCC-1837944.pdf> Walsin Datasheet <https://www.mouser.com/datasheet/2/210/WTC_MLCC_General_Purpose-1534899.pdf> GRM188R61A226ME15D <https://www.mouser.com/datasheet/2/281/1/GRM188R61A226ME15_02A-1985787.pdf> GRM188R61E106MA73D <https://www.mouser.com/datasheet/2/281/1/GRM188R61E106MA73_01A-1985806.pdf> 885012006013 <https://www.mouser.com/datasheet/2/445/885012006013-1726946.pdf> 2220Y6300105KXTWS2 <https://www.mouser.com/datasheet/2/218/SMD_High_and_Std_StackiCap_P62-1825512.pdf> Yageo Class 2, X5R <https://www.mouser.com/datasheet/2/447/UPY_GPHC_X5R_4V_to_50V_26-1827097.pdf> TDK C Series <https://www.mouser.com/ProductDetail/TDK/C3216X5R1V226M160AC?qs=%2Fha2pyFadujbcx9jh7lYl%2F4NeMoXFhdc8AqVWNq4wW6M2y7zl6GzBuhgtI0ngznN> AVX Automotive MLCC <https://www.mouser.com/datasheet/2/40/AutoMLCC-777028.pdf> KEMET X7R Series <https://www.mouser.com/datasheet/2/212/KEM_C1002_X7R_SMD-1102033.pdf>; CAPACITANCE: 0.22µF; DKPN: 399-8049-1-ND; MANUFACTURER: KEMET; MOPN: 80-C0805C224K1R; MPN: C0805C224K1RACTU; TOLERANCE: 10%; VOLTAGE: 100V
C12 C30 = HyTechDevices:CAPACITOR_?_*: Capacitor, Non-Polarized VJ...1BC Series Datasheet <https://www.mouser.com/datasheet/2/427/vjw1bcbascomseries-1762447.pdf> Samsung Datasheet <https://www.mouser.com/datasheet/2/585/MLCC-1837944.pdf> Walsin Datasheet <https://www.mouser.com/datasheet/2/210/WTC_MLCC_General_Purpose-1534899.pdf> GRM188R61A226ME15D <https://www.mouser.com/datasheet/2/281/1/GRM188R61A226ME15_02A-1985787.pdf> GRM188R61E106MA73D <https://www.mouser.com/datasheet/2/281/1/GRM188R61E106MA73_01A-1985806.pdf> 885012006013 <https://www.mouser.com/datasheet/2/445/885012006013-1726946.pdf> 2220Y6300105KXTWS2 <https://www.mouser.com/datasheet/2/218/SMD_High_and_Std_StackiCap_P62-1825512.pdf> Yageo Class 2, X5R <https://www.mouser.com/datasheet/2/447/UPY_GPHC_X5R_4V_to_50V_26-1827097.pdf> TDK C Series <https://www.mouser.com/ProductDetail/TDK/C3216X5R1V226M160AC?qs=%2Fha2pyFadujbcx9jh7lYl%2F4NeMoXFhdc8AqVWNq4wW6M2y7zl6GzBuhgtI0ngznN> AVX Automotive MLCC <https://www.mouser.com/datasheet/2/40/AutoMLCC-777028.pdf> KEMET X7R Series <https://www.mouser.com/datasheet/2/212/KEM_C1002_X7R_SMD-1102033.pdf>; CAPACITANCE: 2.2µF; DKPN: 478-12144-1-ND; MANUFACTURER: AVX Corporation; MOPN: 581-12061C225K4T2A; MPN: 12061C225K4T2A; TOLERANCE: 10%; VOLTAGE: 100V
C13 C27 = HyTechDevices:CAPACITOR_?_*: Capacitor, Non-Polarized VJ...1BC Series Datasheet <https://www.mouser.com/datasheet/2/427/vjw1bcbascomseries-1762447.pdf> Samsung Datasheet <https://www.mouser.com/datasheet/2/585/MLCC-1837944.pdf> Walsin Datasheet <https://www.mouser.com/datasheet/2/210/WTC_MLCC_General_Purpose-1534899.pdf> GRM188R61A226ME15D <https://www.mouser.com/datasheet/2/281/1/GRM188R61A226ME15_02A-1985787.pdf> GRM188R61E106MA73D <https://www.mouser.com/datasheet/2/281/1/GRM188R61E106MA73_01A-1985806.pdf> 885012006013 <https://www.mouser.com/datasheet/2/445/885012006013-1726946.pdf> 2220Y6300105KXTWS2 <https://www.mouser.com/datasheet/2/218/SMD_High_and_Std_StackiCap_P62-1825512.pdf> Yageo Class 2, X5R <https://www.mouser.com/datasheet/2/447/UPY_GPHC_X5R_4V_to_50V_26-1827097.pdf> TDK C Series <https://www.mouser.com/ProductDetail/TDK/C3216X5R1V226M160AC?qs=%2Fha2pyFadujbcx9jh7lYl%2F4NeMoXFhdc8AqVWNq4wW6M2y7zl6GzBuhgtI0ngznN> AVX Automotive MLCC <https://www.mouser.com/datasheet/2/40/AutoMLCC-777028.pdf> KEMET X7R Series <https://www.mouser.com/datasheet/2/212/KEM_C1002_X7R_SMD-1102033.pdf>; CAPACITANCE: 0.1µF; DKPN: 311-1523-1-ND; MANUFACTURER: Yageo; MOPN: 603-CC603KRX7R0BB104; MPN: CC0603KRX7R0BB104; TOLERANCE: 10%; VOLTAGE: 100V
C24 C25 = HyTechDevices:CAPACITOR_?_*: Capacitor, Non-Polarized VJ...1BC Series Datasheet <https://www.mouser.com/datasheet/2/427/vjw1bcbascomseries-1762447.pdf> Samsung Datasheet <https://www.mouser.com/datasheet/2/585/MLCC-1837944.pdf> Walsin Datasheet <https://www.mouser.com/datasheet/2/210/WTC_MLCC_General_Purpose-1534899.pdf> GRM188R61A226ME15D <https://www.mouser.com/datasheet/2/281/1/GRM188R61A226ME15_02A-1985787.pdf> GRM188R61E106MA73D <https://www.mouser.com/datasheet/2/281/1/GRM188R61E106MA73_01A-1985806.pdf> 885012006013 <https://www.mouser.com/datasheet/2/445/885012006013-1726946.pdf> 2220Y6300105KXTWS2 <https://www.mouser.com/datasheet/2/218/SMD_High_and_Std_StackiCap_P62-1825512.pdf> Yageo Class 2, X5R <https://www.mouser.com/datasheet/2/447/UPY_GPHC_X5R_4V_to_50V_26-1827097.pdf> TDK C Series <https://www.mouser.com/ProductDetail/TDK/C3216X5R1V226M160AC?qs=%2Fha2pyFadujbcx9jh7lYl%2F4NeMoXFhdc8AqVWNq4wW6M2y7zl6GzBuhgtI0ngznN> AVX Automotive MLCC <https://www.mouser.com/datasheet/2/40/AutoMLCC-777028.pdf> KEMET X7R Series <https://www.mouser.com/datasheet/2/212/KEM_C1002_X7R_SMD-1102033.pdf>; CAPACITANCE: 0.1µF; DKPN: 720-1688-1-ND; MANUFACTURER: Vishay Vitramon; MOPN: 77-VJ0603Y104JXQPBC; MPN: VJ0603Y104JXQPW1BC; TOLERANCE: 5%; VOLTAGE: 10V
C26 C28 = HyTechDevices:CAPACITOR_?_*: Capacitor, Non-Polarized VJ...1BC Series Datasheet <https://www.mouser.com/datasheet/2/427/vjw1bcbascomseries-1762447.pdf> Samsung Datasheet <https://www.mouser.com/datasheet/2/585/MLCC-1837944.pdf> Walsin Datasheet <https://www.mouser.com/datasheet/2/210/WTC_MLCC_General_Purpose-1534899.pdf> GRM188R61A226ME15D <https://www.mouser.com/datasheet/2/281/1/GRM188R61A226ME15_02A-1985787.pdf> GRM188R61E106MA73D <https://www.mouser.com/datasheet/2/281/1/GRM188R61E106MA73_01A-1985806.pdf> 885012006013 <https://www.mouser.com/datasheet/2/445/885012006013-1726946.pdf> 2220Y6300105KXTWS2 <https://www.mouser.com/datasheet/2/218/SMD_High_and_Std_StackiCap_P62-1825512.pdf> Yageo Class 2, X5R <https://www.mouser.com/datasheet/2/447/UPY_GPHC_X5R_4V_to_50V_26-1827097.pdf> TDK C Series <https://www.mouser.com/ProductDetail/TDK/C3216X5R1V226M160AC?qs=%2Fha2pyFadujbcx9jh7lYl%2F4NeMoXFhdc8AqVWNq4wW6M2y7zl6GzBuhgtI0ngznN> AVX Automotive MLCC <https://www.mouser.com/datasheet/2/40/AutoMLCC-777028.pdf> KEMET X7R Series <https://www.mouser.com/datasheet/2/212/KEM_C1002_X7R_SMD-1102033.pdf>; CAPACITANCE: 10nF; DKPN: 311-4054-1-ND; MANUFACTURER: Yageo; MOPN: 603-CC603KRX7R6BB103; MPN: CC0603KRX7R6BB103; TOLERANCE: 10%; VOLTAGE: 10V
F0 F1-F22 = HyTechDevices:FUSE_?_*: Fuse 0885 Series <https://www.mouser.com/datasheet/2/240/Littelfuse_Fuse_885_Datasheet_pdf-1371443.pdf>; CURRENT: 1.6A; DKPN: F10987CT-ND; MANUFACTURER: Littelfuse Inc.; MOPN: 576-088501.6DR; MPN: 088501.6DR; VOLTAGE: 500V
J0 J1-J18 J29-J31 = HyTechDevices:CONNECTOR-1_?_*: 1 Pin Connector Pogo pin datasheet <https://www.mouser.com/datasheet/2/273/Mill-Max_03212019_807-22-001-10-020101-1545127.pdf> 5222 Spring datasheet <https://www.mouser.com/datasheet/2/215/5222-743174.pdf>; DKPN: 36-5222-ND; MANUFACTURER: Keystone Electronics; MODEL: SPRING; MOPN: 534-5222; MPN: 5222
J27 J28 J32-J35 J37-J40 = HyTechDevices:CONNECTOR-2_?_*: 2 Pin Connector; DKPN: 436500214; MANUFACTURER: Molex; MOPN: 538-43650-0214; MPN: 436500214
L1 L2 = HyTechDevices:INDUCTOR_?_*: Inductor 74451133 Inductor <https://www.we-online.com/catalog/datasheet/74451133.pdf> SRU1408 Datasheet <https://www.mouser.com/datasheet/2/54/SRU1048-1391431.pdf>; CURRENT_RATED: 0.6A; CURRENT_SATURATION: 0.15A; DCR: 0.19Ω; DKPN: 732-1410-1-ND; INDUCTANCE: 33µH; MANUFACTURER: Würth Elektronik; MOPN: 710-74451133; MPN: 74451133; TOLERANCE: 20%
R1 R8 = HyTechDevices:RESISTOR_?_*: Resistor PWR163 Series <https://www.mouser.com/datasheet/2/54/pwr163-777985.pdf> AC Series <https://www.mouser.com/datasheet/2/447/Yageo_PYu_AC_51_RoHS_L_7_1714230-1874691.pdf> PU Series <https://www.mouser.com/datasheet/2/447/PYu-PU_51_RoHS_L_6-1504619.pdf> ERA Series <https://www.mouser.com/datasheet/2/315/AOA0000C307-1149632.pdf> PWR263 Series <https://www.mouser.com/datasheet/2/54/pwr263s_35-778069.pdf> RC Series <https://www.mouser.com/datasheet/2/447/Yageo_03_18_2021_PYu_RC_Group_51_RoHS_L_11-2199992.pdf> ERJ PB3, PB6 Series <https://www.mouser.com/datasheet/2/315/AOA0000C328-1530132.pdf> ERJ PA2, P03, PA3, P06, P08, P14 Series <https://www.mouser.com/datasheet/2/315/AOA0000C331-1141874.pdf>; DKPN: 311-374KHRCT-ND; MANUFACTURER: Yageo; MOPN: 603-RC0603FR-07374KL; MPN: RC0603FR-07374KL; POWER: 0.1W; RESISTANCE: 374k; TOLERANCE: 1%; VOLTAGE_CONTINUOUS: 75V; VOLTAGE_MAX: 75V
R2 R9 = HyTechDevices:RESISTOR_?_*: Resistor PWR163 Series <https://www.mouser.com/datasheet/2/54/pwr163-777985.pdf> AC Series <https://www.mouser.com/datasheet/2/447/Yageo_PYu_AC_51_RoHS_L_7_1714230-1874691.pdf> PU Series <https://www.mouser.com/datasheet/2/447/PYu-PU_51_RoHS_L_6-1504619.pdf> ERA Series <https://www.mouser.com/datasheet/2/315/AOA0000C307-1149632.pdf> PWR263 Series <https://www.mouser.com/datasheet/2/54/pwr263s_35-778069.pdf> RC Series <https://www.mouser.com/datasheet/2/447/Yageo_03_18_2021_PYu_RC_Group_51_RoHS_L_11-2199992.pdf> ERJ PB3, PB6 Series <https://www.mouser.com/datasheet/2/315/AOA0000C328-1530132.pdf> ERJ PA2, P03, PA3, P06, P08, P14 Series <https://www.mouser.com/datasheet/2/315/AOA0000C331-1141874.pdf>; DKPN: P470BYCT-ND; MANUFACTURER: Panasonic Electronic Components; MOPN: 667-ERJ-PA3F4700V; MPN: ERJ-PA3F4700V; POWER: 0.25W; RESISTANCE: 470; TOLERANCE: 1%; VOLTAGE_CONTINUOUS: 10.84V; VOLTAGE_MAX: 150V
R3 R24 R33 R38 R39 R41-R48 R53 = HyTechDevices:RESISTOR_?_*: Resistor PWR163 Series <https://www.mouser.com/datasheet/2/54/pwr163-777985.pdf> AC Series <https://www.mouser.com/datasheet/2/447/Yageo_PYu_AC_51_RoHS_L_7_1714230-1874691.pdf> PU Series <https://www.mouser.com/datasheet/2/447/PYu-PU_51_RoHS_L_6-1504619.pdf> ERA Series <https://www.mouser.com/datasheet/2/315/AOA0000C307-1149632.pdf> PWR263 Series <https://www.mouser.com/datasheet/2/54/pwr263s_35-778069.pdf> RC Series <https://www.mouser.com/datasheet/2/447/Yageo_03_18_2021_PYu_RC_Group_51_RoHS_L_11-2199992.pdf> ERJ PB3, PB6 Series <https://www.mouser.com/datasheet/2/315/AOA0000C328-1530132.pdf> ERJ PA2, P03, PA3, P06, P08, P14 Series <https://www.mouser.com/datasheet/2/315/AOA0000C331-1141874.pdf>; DKPN: 311-100HRCT-ND; MANUFACTURER: Yageo; MOPN: 603-RC0603FR-07100RL; MPN: RC0603FR-07100RL; POWER: 0.1W; RESISTANCE: 100; TOLERANCE: 1%; VOLTAGE_CONTINUOUS: 3.16V; VOLTAGE_MAX: 75V
R4 R5 = HyTechDevices:RESISTOR_?_*: Resistor PWR163 Series <https://www.mouser.com/datasheet/2/54/pwr163-777985.pdf> AC Series <https://www.mouser.com/datasheet/2/447/Yageo_PYu_AC_51_RoHS_L_7_1714230-1874691.pdf> PU Series <https://www.mouser.com/datasheet/2/447/PYu-PU_51_RoHS_L_6-1504619.pdf> ERA Series <https://www.mouser.com/datasheet/2/315/AOA0000C307-1149632.pdf> PWR263 Series <https://www.mouser.com/datasheet/2/54/pwr263s_35-778069.pdf> RC Series <https://www.mouser.com/datasheet/2/447/Yageo_03_18_2021_PYu_RC_Group_51_RoHS_L_11-2199992.pdf> ERJ PB3, PB6 Series <https://www.mouser.com/datasheet/2/315/AOA0000C328-1530132.pdf> ERJ PA2, P03, PA3, P06, P08, P14 Series <https://www.mouser.com/datasheet/2/315/AOA0000C331-1141874.pdf>; DKPN: 311-402HRCT-ND; MANUFACTURER: Yageo; MOPN: 603-RC0603FR-07402RL; MPN: RC0603FR-07402RL; POWER: 0.1W; RESISTANCE: 402; TOLERANCE: 1%; VOLTAGE_CONTINUOUS: 6.34V; VOLTAGE_MAX: 75V
R6 R7 R49 R50 = HyTechDevices:RESISTOR_?_*: Resistor PWR163 Series <https://www.mouser.com/datasheet/2/54/pwr163-777985.pdf> AC Series <https://www.mouser.com/datasheet/2/447/Yageo_PYu_AC_51_RoHS_L_7_1714230-1874691.pdf> PU Series <https://www.mouser.com/datasheet/2/447/PYu-PU_51_RoHS_L_6-1504619.pdf> ERA Series <https://www.mouser.com/datasheet/2/315/AOA0000C307-1149632.pdf> PWR263 Series <https://www.mouser.com/datasheet/2/54/pwr263s_35-778069.pdf> RC Series <https://www.mouser.com/datasheet/2/447/Yageo_03_18_2021_PYu_RC_Group_51_RoHS_L_11-2199992.pdf> ERJ PB3, PB6 Series <https://www.mouser.com/datasheet/2/315/AOA0000C328-1530132.pdf> ERJ PA2, P03, PA3, P06, P08, P14 Series <https://www.mouser.com/datasheet/2/315/AOA0000C331-1141874.pdf>; DKPN: 311-22.0HRCT-ND; MANUFACTURER: Yageo; MOPN: 603-RC0603FR-0722RL; MPN: RC0603FR-0722RL; POWER: 0.1W; RESISTANCE: 22; TOLERANCE: 1%; VOLTAGE_CONTINUOUS: 1.48V; VOLTAGE_MAX: 75V
R10-R13 R18-R21 R40 R51 R52 = HyTechDevices:RESISTOR_?_*: Resistor PWR163 Series <https://www.mouser.com/datasheet/2/54/pwr163-777985.pdf> AC Series <https://www.mouser.com/datasheet/2/447/Yageo_PYu_AC_51_RoHS_L_7_1714230-1874691.pdf> PU Series <https://www.mouser.com/datasheet/2/447/PYu-PU_51_RoHS_L_6-1504619.pdf> ERA Series <https://www.mouser.com/datasheet/2/315/AOA0000C307-1149632.pdf> PWR263 Series <https://www.mouser.com/datasheet/2/54/pwr263s_35-778069.pdf> RC Series <https://www.mouser.com/datasheet/2/447/Yageo_03_18_2021_PYu_RC_Group_51_RoHS_L_11-2199992.pdf> ERJ PB3, PB6 Series <https://www.mouser.com/datasheet/2/315/AOA0000C328-1530132.pdf> ERJ PA2, P03, PA3, P06, P08, P14 Series <https://www.mouser.com/datasheet/2/315/AOA0000C331-1141874.pdf>; RESISTANCE: DNP
R25 R26 R31 R32 R34-R37 = HyTechDevices:RESISTOR_?_*: Resistor PWR163 Series <https://www.mouser.com/datasheet/2/54/pwr163-777985.pdf> AC Series <https://www.mouser.com/datasheet/2/447/Yageo_PYu_AC_51_RoHS_L_7_1714230-1874691.pdf> PU Series <https://www.mouser.com/datasheet/2/447/PYu-PU_51_RoHS_L_6-1504619.pdf> ERA Series <https://www.mouser.com/datasheet/2/315/AOA0000C307-1149632.pdf> PWR263 Series <https://www.mouser.com/datasheet/2/54/pwr263s_35-778069.pdf> RC Series <https://www.mouser.com/datasheet/2/447/Yageo_03_18_2021_PYu_RC_Group_51_RoHS_L_11-2199992.pdf> ERJ PB3, PB6 Series <https://www.mouser.com/datasheet/2/315/AOA0000C328-1530132.pdf> ERJ PA2, P03, PA3, P06, P08, P14 Series <https://www.mouser.com/datasheet/2/315/AOA0000C331-1141874.pdf>; DKPN: P20020CT-ND; MANUFACTURER: Panasonic Electronic Components; MOPN: 667-ERJ-PB3B2741V; MPN: ERJ-PB3B2741V; POWER: 0.2W; RESISTANCE: 2.74k; TOLERANCE: 0.1%; VOLTAGE_CONTINUOUS: 23.41V; VOLTAGE_MAX: 150V
R27-R30 = HyTechDevices:RESISTOR_?_*: Resistor PWR163 Series <https://www.mouser.com/datasheet/2/54/pwr163-777985.pdf> AC Series <https://www.mouser.com/datasheet/2/447/Yageo_PYu_AC_51_RoHS_L_7_1714230-1874691.pdf> PU Series <https://www.mouser.com/datasheet/2/447/PYu-PU_51_RoHS_L_6-1504619.pdf> ERA Series <https://www.mouser.com/datasheet/2/315/AOA0000C307-1149632.pdf> PWR263 Series <https://www.mouser.com/datasheet/2/54/pwr263s_35-778069.pdf> RC Series <https://www.mouser.com/datasheet/2/447/Yageo_03_18_2021_PYu_RC_Group_51_RoHS_L_11-2199992.pdf> ERJ PB3, PB6 Series <https://www.mouser.com/datasheet/2/315/AOA0000C328-1530132.pdf> ERJ PA2, P03, PA3, P06, P08, P14 Series <https://www.mouser.com/datasheet/2/315/AOA0000C331-1141874.pdf>; DKPN: 311-1.00KHRCT-ND; MANUFACTURER: Yageo; MOPN: 603-RC0603FR-071KL; MPN: RC0603FR-071KL; POWER: 0.1W; RESISTANCE: 1k; TOLERANCE: 1%; VOLTAGE_CONTINUOUS: 10.00V; VOLTAGE_MAX: 75V
T1 = HyTechDevices:TRANSFORMER: 2 Channel SMT Transformer Specs for both HM2102NL and HM2112ZNL Transformers Turns ratio: 1CT: 1CT Isolation Voltage: 4300 VDC Inductance: 150 uH Leakage Inductance: 0.50 uH max HM2102NLT: DataSheet <https://www.mouser.com/datasheet/2/336/HM2102NL-1218600.pdf> HM2112ZNLT: DataSheet <https://www.mouser.com/datasheet/2/336/HM2112ZNL-1224892.pdf>; DKPN: 1840-1036-1-ND; MANUFACTURER: Pulse Electronics; MOPN: 673-HM2112ZNLT; MPN: HM2112ZNLT
TP1 TP2 TP4 TP5 TP7-TP12 = HyTechDevices:TEST_POINT: Test Point; DKPN: 36-5015CT-ND; MANUFACTURER: Keystone Electronics; MOPN: 534-5015; MPN: 5015
U1 U2 = HyTechDevices:LTC6811-2: LTC6811-2 12 Cell Stackable Battery Monitor Datasheet <https://www.mouser.com/datasheet/2/609/LTC6811_1_6811_2-1271909.pdf>; DKPN: LTC6811IG-2#3ZZPBF-ND; MANUFACTURER: Analog Devices Inc.; MOPN: 584-6811IG-2#3ZZPB; MPN: LTC6811IG-2#3ZZPBF
U3 U4 = HyTechDevices:SHT3*-ARP-B: Humidity and Temperature Sensor SHT30: Low Grade SHT31: High Grade Datasheet <https://www.mouser.com/datasheet/2/682/Sensirion_Humidity_Sensors_SHT3x_Datasheet_analog-2001011.pdf>; DKPN: 1649-1012-1-ND; MANUFACTURER: Sensirion AG; MOPN: 403-SHT31-ARP-B; MPN: SHT31-ARP-B
U5 U6 = HyTechDevices:LT3990-5: LT3990-5 DC-DC Converter Datasheet <https://www.mouser.com/datasheet/2/609/3990fa-1270774.pdf>; DKPN: LT3990EMSE-5#PBF-ND; MANUFACTURER: Analog Devices Inc.; MOPN: 584-LT3990EMSE-5#PBF; MPN: LT3990EMSE-5#PBF

## Module CELL
Ports: CELL+(in) S(N)(in) C(N)(out) CELL-(out) V-(pwr)
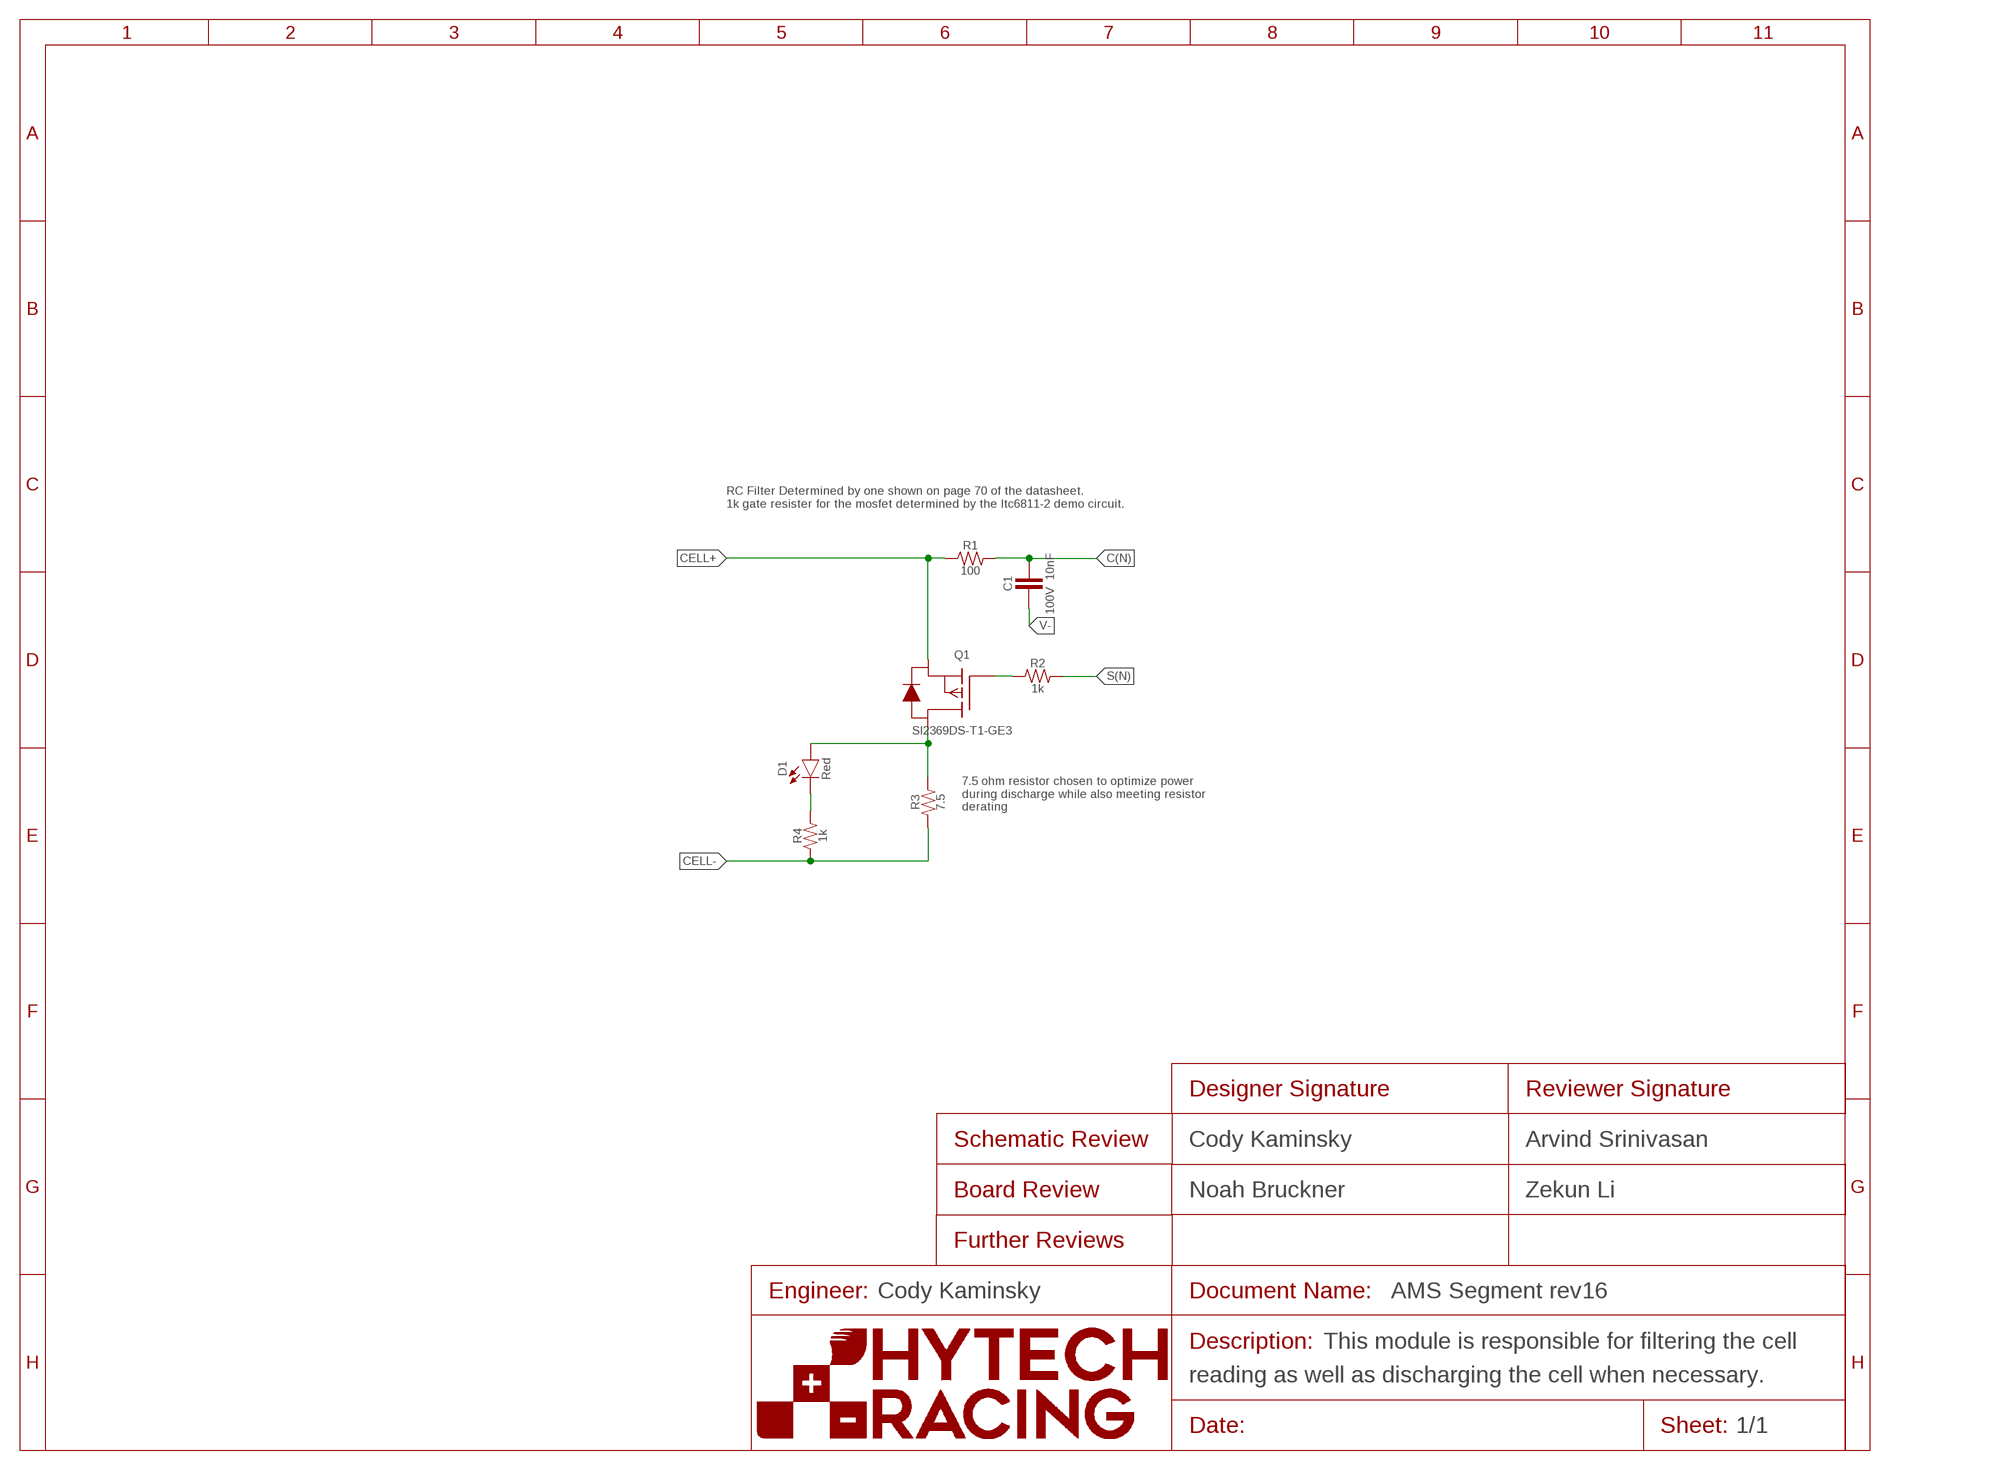
[diagram p2: schematic, module CELL, sheet 1]
FRAME1 (FRAME): DESCRIPTION_1: This module is responsible for filtering the cell; DESCRIPTION_2: reading as well as discharging the cell when necessary.; DESIGNER_BOARD: Noah Bruckner; DESIGNER_SCHEMATIC: Cody Kaminsky; ENGINEER: Cody Kaminsky; REVIEWER_BOARD: Zekun Li; REVIEWER_SCHEMATIC: Arvind Srinivasan

### Parts
C1  CAPACITOR_0603_100V_10NF  [0603-CAP]
D1  LED_0603_RED  [0603-LED]
Q1  TRANSISTOR_P_MOS_SOT23_SI2369DS-T1-GE3  [SOT-23]
R1  RESISTOR_0603_100  [0603-RES]
R2  RESISTOR_0603_1K  [0603-RES]
R3  RESISTOR_PWR263_7.5  [PWR263]
R4  RESISTOR_0603_1K  [0603-RES]

### Nets
C(N): C1.1 R1.2
CELL+: Q1.2(S) R1.1
CELL-: R3.1 R4.1
N$5: Q1.1(G) R2.1
N$6: D1.2(A) Q1.3(D) R3.2
N$7: D1.1(C) R4.2
S(N): R2.2
V-: C1.2

### Notes on the sheet
- RC Filter Determined by one shown on page 70 of the datasheet.
  1k gate resister for the mosfet determined by the ltc6811-2 demo circuit.
- 7.5 ohm resistor chosen to optimize power
  during discharge while also meeting resistor
  derating

### Library data of the parts
C1 = HyTechDevices:CAPACITOR_?_*: Capacitor, Non-Polarized VJ...1BC Series Datasheet <https://www.mouser.com/datasheet/2/427/vjw1bcbascomseries-1762447.pdf> Samsung Datasheet <https://www.mouser.com/datasheet/2/585/MLCC-1837944.pdf> Walsin Datasheet <https://www.mouser.com/datasheet/2/210/WTC_MLCC_General_Purpose-1534899.pdf> GRM188R61A226ME15D <https://www.mouser.com/datasheet/2/281/1/GRM188R61A226ME15_02A-1985787.pdf> GRM188R61E106MA73D <https://www.mouser.com/datasheet/2/281/1/GRM188R61E106MA73_01A-1985806.pdf> 885012006013 <https://www.mouser.com/datasheet/2/445/885012006013-1726946.pdf> 2220Y6300105KXTWS2 <https://www.mouser.com/datasheet/2/218/SMD_High_and_Std_StackiCap_P62-1825512.pdf> Yageo Class 2, X5R <https://www.mouser.com/datasheet/2/447/UPY_GPHC_X5R_4V_to_50V_26-1827097.pdf> TDK C Series <https://www.mouser.com/ProductDetail/TDK/C3216X5R1V226M160AC?qs=%2Fha2pyFadujbcx9jh7lYl%2F4NeMoXFhdc8AqVWNq4wW6M2y7zl6GzBuhgtI0ngznN> AVX Automotive MLCC <https://www.mouser.com/datasheet/2/40/AutoMLCC-777028.pdf> KEMET X7R Series <https://www.mouser.com/datasheet/2/212/KEM_C1002_X7R_SMD-1102033.pdf>; CAPACITANCE: 10nF; DKPN: 311-1788-1-ND; MANUFACTURER: Yageo; MOPN: 603-CC603KRX7R0BB103; MPN: CC0603KRX7R0BB103; TOLERANCE: 10%; VOLTAGE: 100V
D1 = HyTechDevices:LED_?_*: LED Blue <https://www.mouser.com/datasheet/2/216/APT1608VBC_D-246010.pdf> Green <https://www.mouser.com/datasheet/2/216/APT1608ZGCK-1173388.pdf> Orange <https://www.mouser.com/datasheet/2/216/APT1608SECK-6197.pdf> Red <https://www.mouser.com/datasheet/2/216/APT1608SECK-J3-PRV-1173336.pdf> White <https://www.mouser.com/datasheet/2/50/SM0603UWC-880813.pdf> Yellow <https://www.mouser.com/datasheet/2/216/APT1608SYCK-J3-PRV-1173311.pdf>; COLOR: Red; DKPN: 754-1786-1-ND; MANUFACTURER: Kingbright; MOPN: 604-APT1608SECKJ3PRV; MPN: APT1608SECK/J3-PRV
Q1 = HyTechDevices:TRANSISTOR_P_MOS_?_*: MOSFET P Channel Datasheet <https://www.mouser.com/datasheet/2/427/si2369d-1764360.pdf>; DKPN: SI2369DS-T1-GE3CT-ND; MANUFACTURER: Vishay Siliconix; MOPN: 78-SI2369DS-T1-GE3; MPN: SI2369DS-T1-GE3
R1 = HyTechDevices:RESISTOR_?_*: Resistor PWR163 Series <https://www.mouser.com/datasheet/2/54/pwr163-777985.pdf> AC Series <https://www.mouser.com/datasheet/2/447/Yageo_PYu_AC_51_RoHS_L_7_1714230-1874691.pdf> PU Series <https://www.mouser.com/datasheet/2/447/PYu-PU_51_RoHS_L_6-1504619.pdf> ERA Series <https://www.mouser.com/datasheet/2/315/AOA0000C307-1149632.pdf> PWR263 Series <https://www.mouser.com/datasheet/2/54/pwr263s_35-778069.pdf> RC Series <https://www.mouser.com/datasheet/2/447/Yageo_03_18_2021_PYu_RC_Group_51_RoHS_L_11-2199992.pdf> ERJ PB3, PB6 Series <https://www.mouser.com/datasheet/2/315/AOA0000C328-1530132.pdf> ERJ PA2, P03, PA3, P06, P08, P14 Series <https://www.mouser.com/datasheet/2/315/AOA0000C331-1141874.pdf>; DKPN: 311-100HRCT-ND; MANUFACTURER: Yageo; MOPN: 603-RC0603FR-07100RL; MPN: RC0603FR-07100RL; POWER: 0.1W; RESISTANCE: 100; TOLERANCE: 1%; VOLTAGE_CONTINUOUS: 3.16V; VOLTAGE_MAX: 75V
R2 R4 = HyTechDevices:RESISTOR_?_*: Resistor PWR163 Series <https://www.mouser.com/datasheet/2/54/pwr163-777985.pdf> AC Series <https://www.mouser.com/datasheet/2/447/Yageo_PYu_AC_51_RoHS_L_7_1714230-1874691.pdf> PU Series <https://www.mouser.com/datasheet/2/447/PYu-PU_51_RoHS_L_6-1504619.pdf> ERA Series <https://www.mouser.com/datasheet/2/315/AOA0000C307-1149632.pdf> PWR263 Series <https://www.mouser.com/datasheet/2/54/pwr263s_35-778069.pdf> RC Series <https://www.mouser.com/datasheet/2/447/Yageo_03_18_2021_PYu_RC_Group_51_RoHS_L_11-2199992.pdf> ERJ PB3, PB6 Series <https://www.mouser.com/datasheet/2/315/AOA0000C328-1530132.pdf> ERJ PA2, P03, PA3, P06, P08, P14 Series <https://www.mouser.com/datasheet/2/315/AOA0000C331-1141874.pdf>; DKPN: 311-1.00KHRCT-ND; MANUFACTURER: Yageo; MOPN: 603-RC0603FR-071KL; MPN: RC0603FR-071KL; POWER: 0.1W; RESISTANCE: 1k; TOLERANCE: 1%; VOLTAGE_CONTINUOUS: 10.00V; VOLTAGE_MAX: 75V
R3 = HyTechDevices:RESISTOR_?_*: Resistor PWR163 Series <https://www.mouser.com/datasheet/2/54/pwr163-777985.pdf> AC Series <https://www.mouser.com/datasheet/2/447/Yageo_PYu_AC_51_RoHS_L_7_1714230-1874691.pdf> PU Series <https://www.mouser.com/datasheet/2/447/PYu-PU_51_RoHS_L_6-1504619.pdf> ERA Series <https://www.mouser.com/datasheet/2/315/AOA0000C307-1149632.pdf> PWR263 Series <https://www.mouser.com/datasheet/2/54/pwr263s_35-778069.pdf> RC Series <https://www.mouser.com/datasheet/2/447/Yageo_03_18_2021_PYu_RC_Group_51_RoHS_L_11-2199992.pdf> ERJ PB3, PB6 Series <https://www.mouser.com/datasheet/2/315/AOA0000C328-1530132.pdf> ERJ PA2, P03, PA3, P06, P08, P14 Series <https://www.mouser.com/datasheet/2/315/AOA0000C331-1141874.pdf>; DKPN: PWR263S-35-7R50J-ND; MANUFACTURER: Bourns Inc.; MOPN: 652-PWR263S357R50J; MPN: PWR263S-35-7R50J; POWER: 3.5W; RESISTANCE: 7.5; TOLERANCE: 5%; VOLTAGE_CONTINUOUS: 5.123V; VOLTAGE_MAX: 5.123V

## Net classes
1 Upper_Unfused: width 0.508 mm, drill 0.686 mm, clearance 1.6 mm to class 0, clearance 1.6 mm
2 Lower_Unfused: width 0.508 mm, drill 0.686 mm, clearance 1.6 mm to class 0, clearance 1.6 mm to class 1, clearance 1.6 mm
3 Upper Power: clearance 1.6 mm to class 1, clearance 1.6 mm to class 2
4 Lower Power: clearance 1.6 mm to class 1, clearance 1.6 mm to class 2, clearance 1.6 mm to class 3
5 IsoSPI: clearance 1.6 mm to class 1, clearance 1.6 mm to class 2, clearance 1.6 mm to class 3, clearance 1.6 mm to class 4